# Altium project VISION_BETA_EBB.PrjPcb (part 5 of 9)

## Sheet GMSL_DESERIALIZER.SchDoc
size C; SheetNumber: 3; SheetTotal: 19
Used 2 times, as channels GMSL_DESERIALIZER_0, GMSL_DESERIALIZER_1. Parts and nets are listed once, with the designators drawn on the sheet.
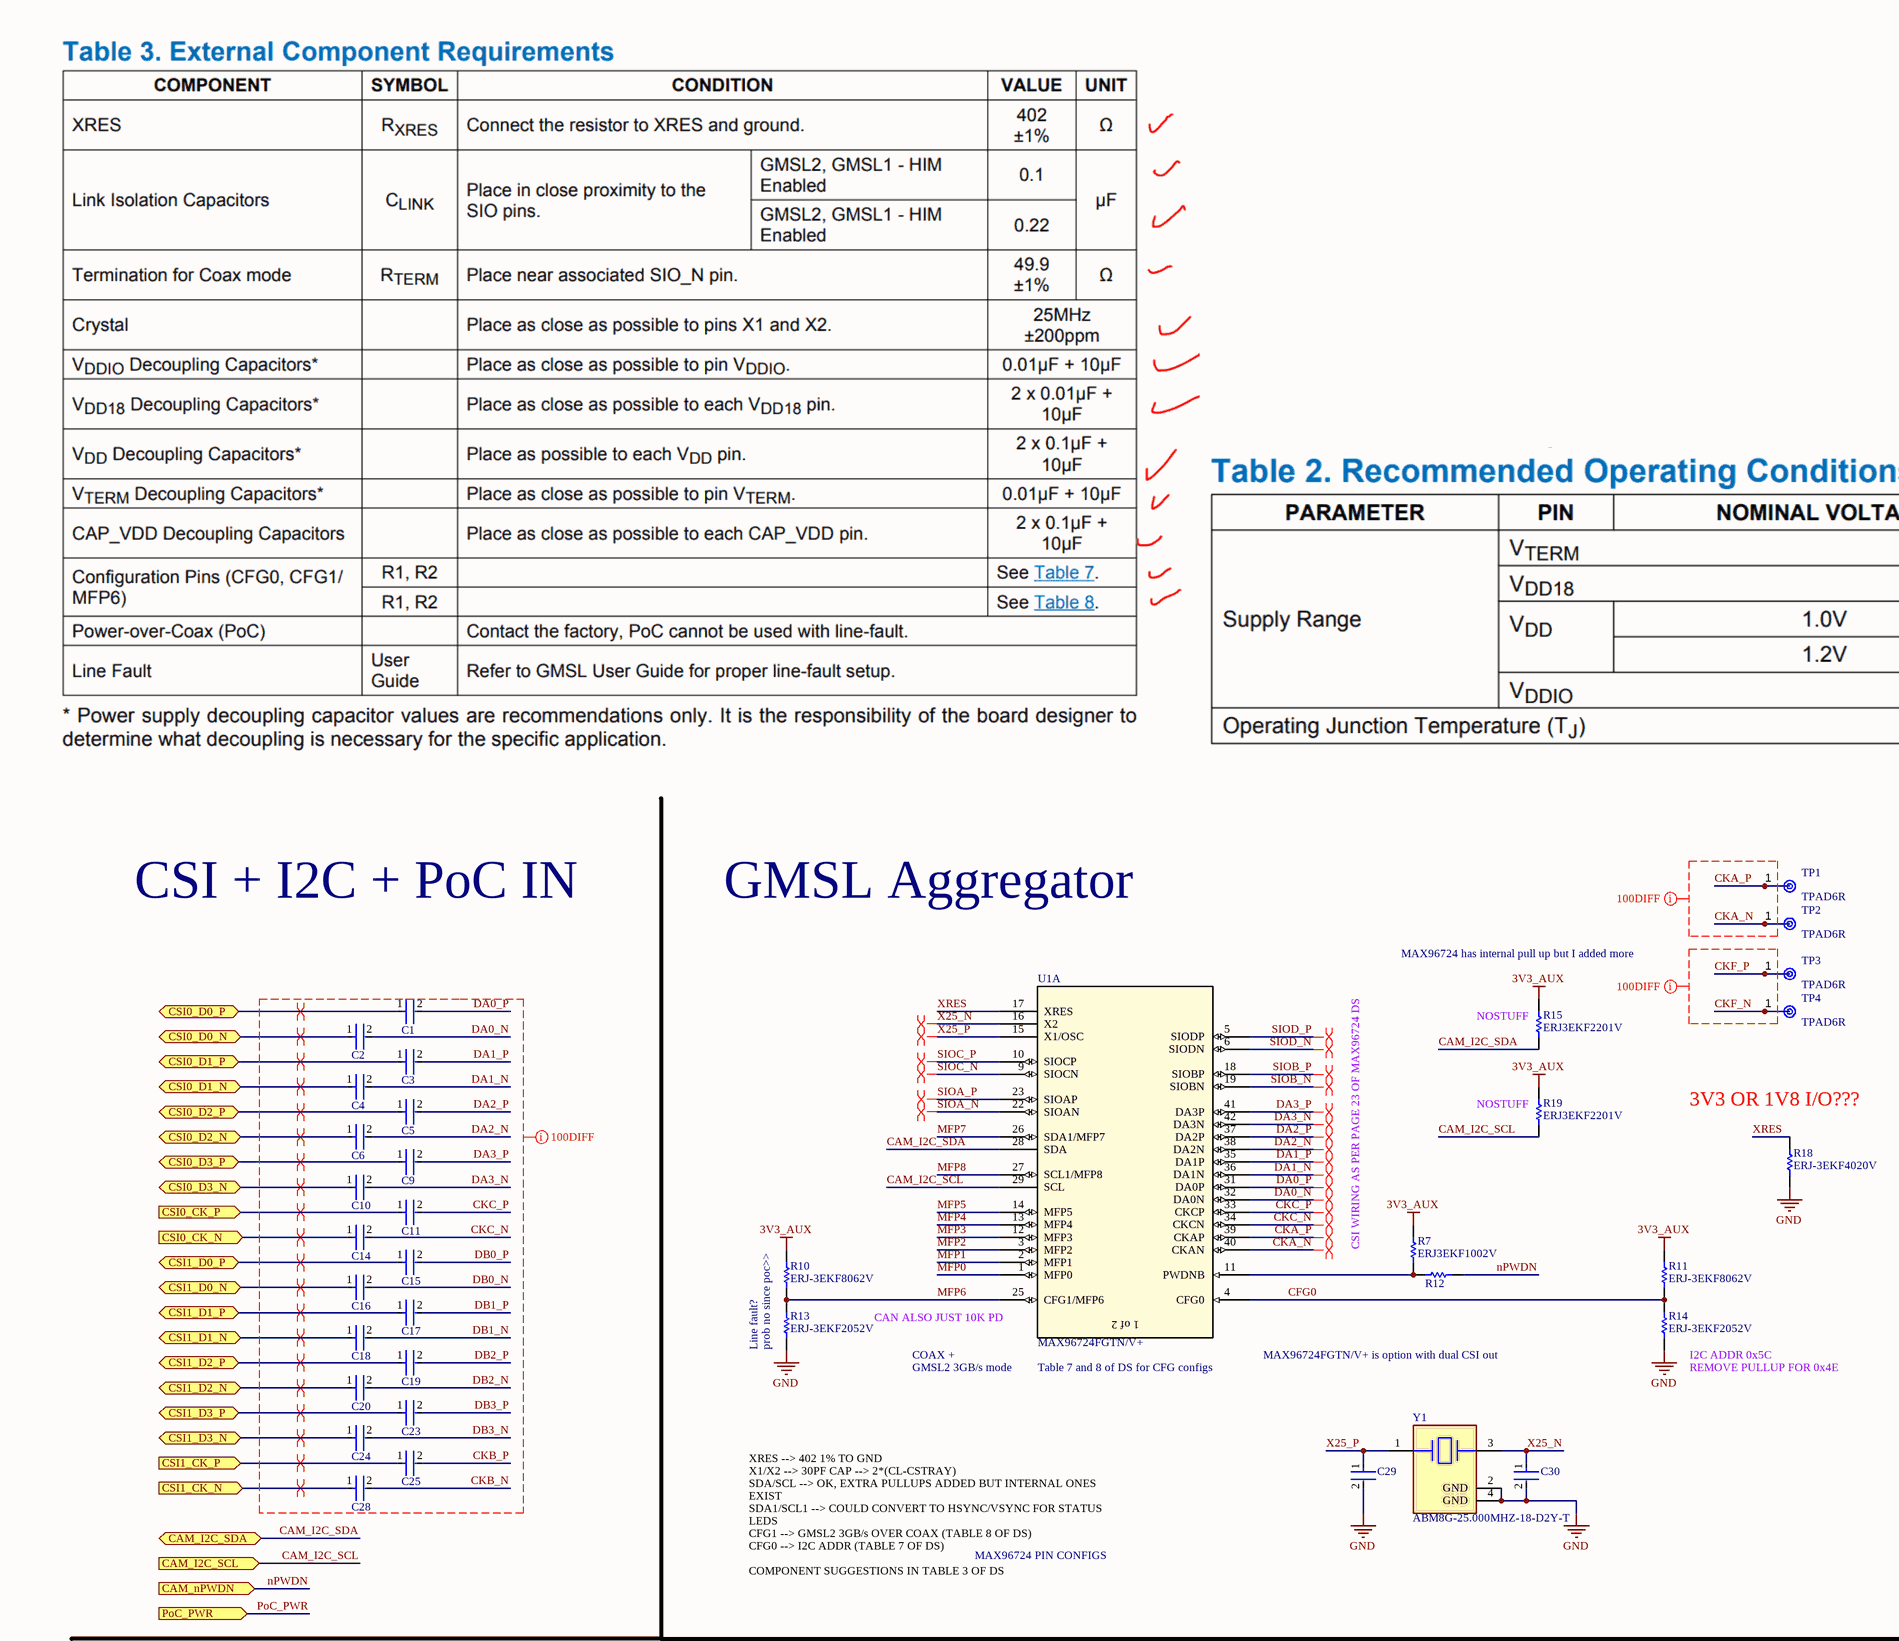
[diagram p23: GMSL_DESERIALIZER.SchDoc, top left]
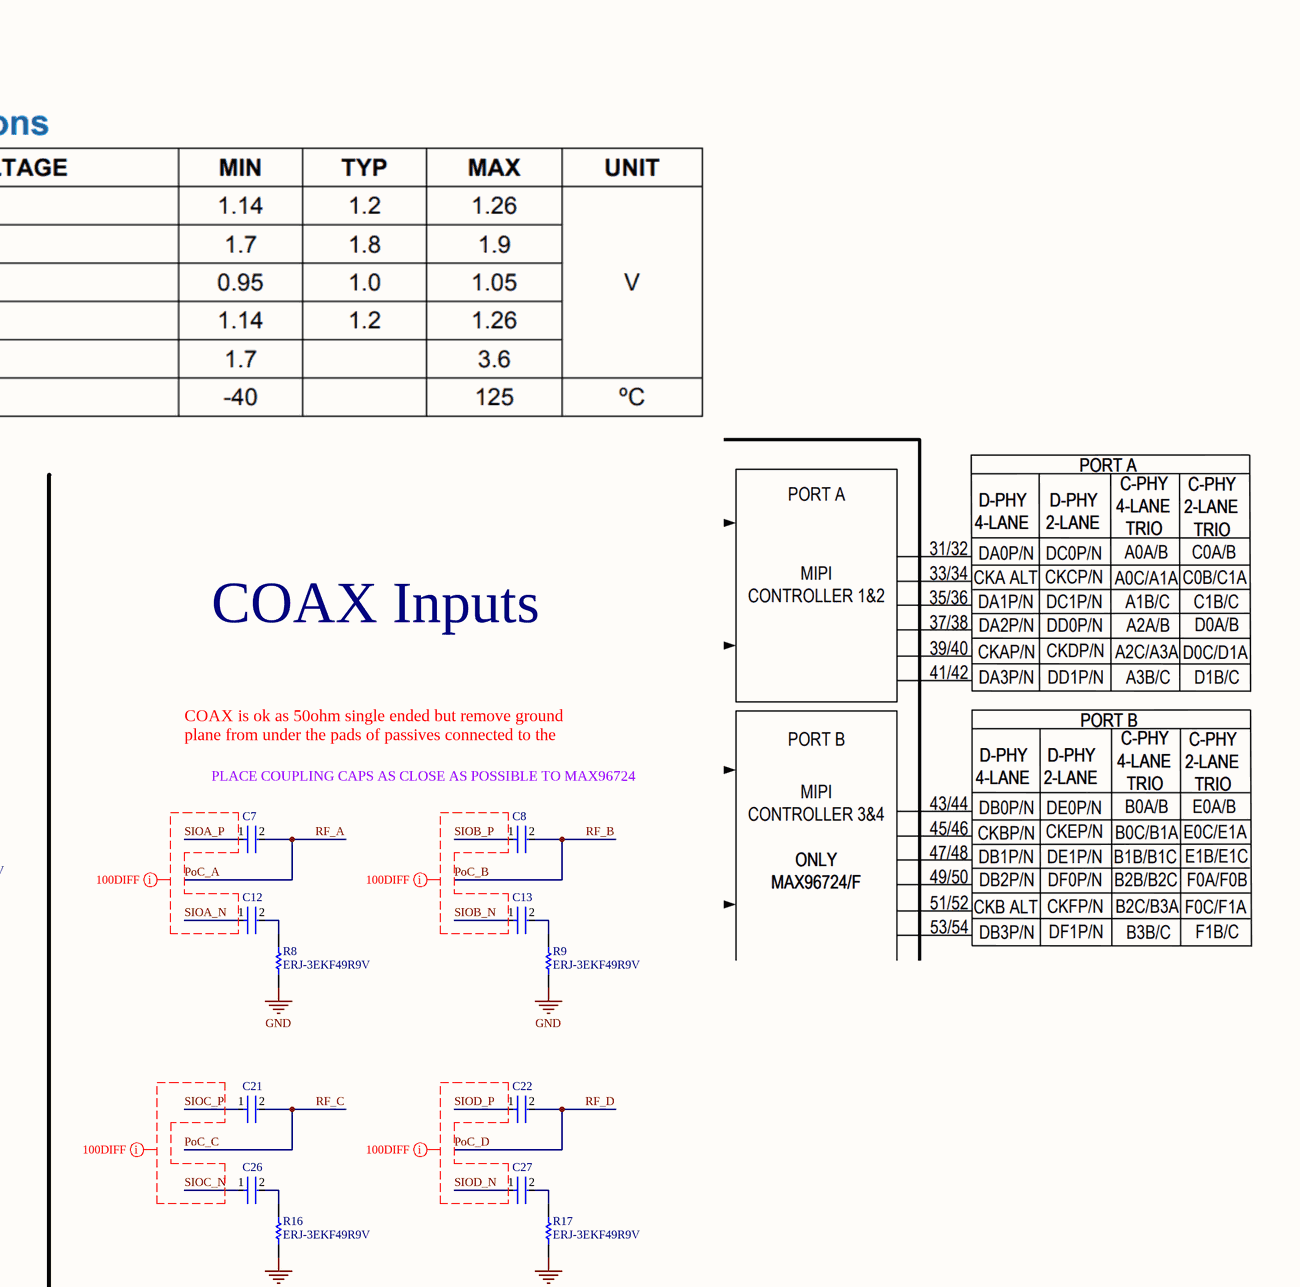
[diagram p24: GMSL_DESERIALIZER.SchDoc, top right]
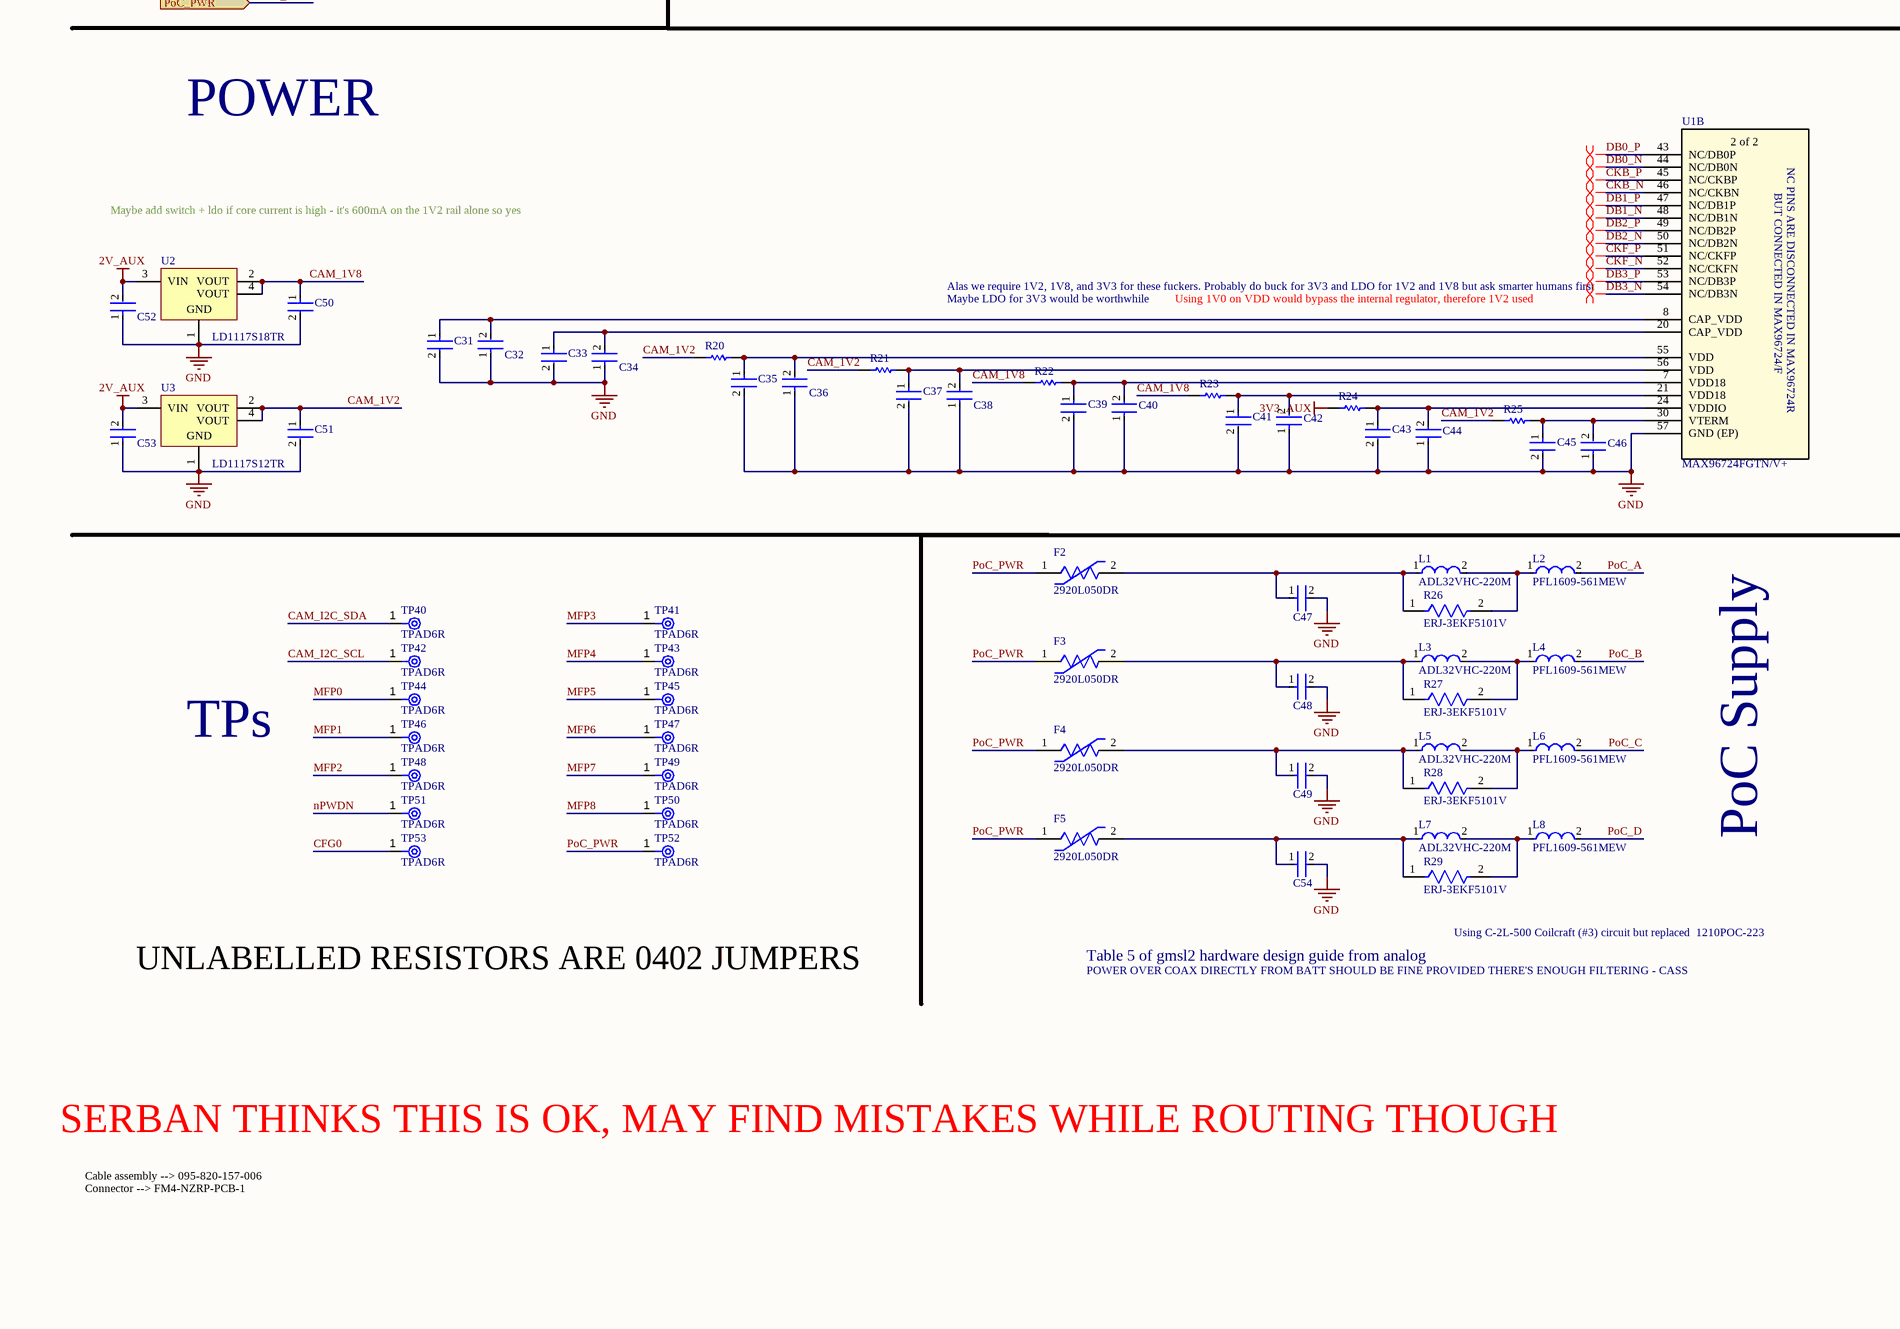
[diagram p25: GMSL_DESERIALIZER.SchDoc, bottom left]
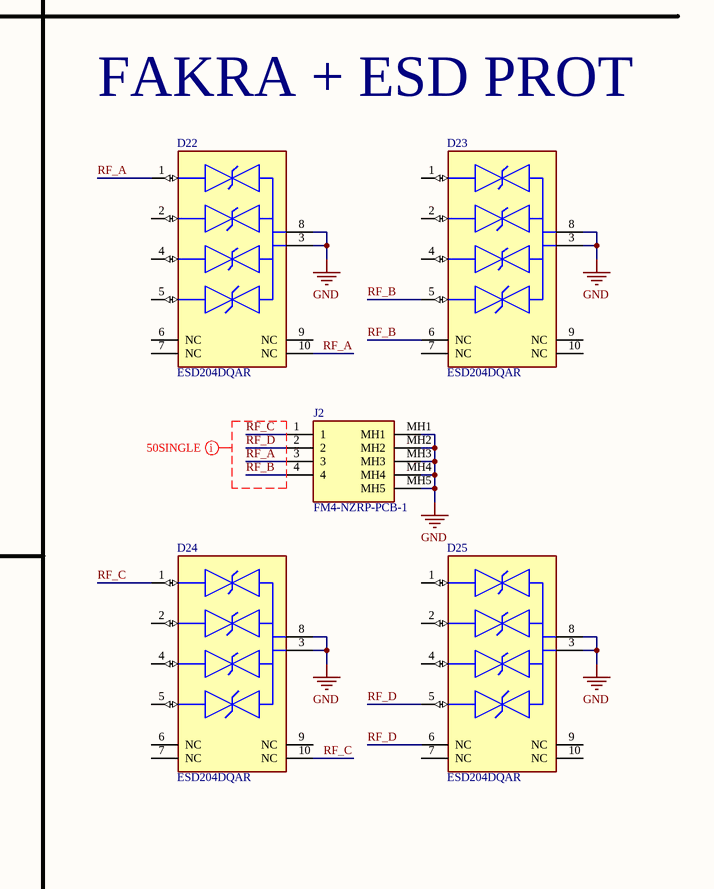
[diagram p26: GMSL_DESERIALIZER.SchDoc, bottom right]

### Parts
C1  C1005X7R1H104K050BB  [FP-C1005-050-0_05-IPC_C]  (value not drawn)
C2  C1005X7R1H104K050BB  [FP-C1005-050-0_05-IPC_C]  (value not drawn)
C3  C1005X7R1H104K050BB  [FP-C1005-050-0_05-IPC_C]  (value not drawn)
C4  C1005X7R1H104K050BB  [FP-C1005-050-0_05-IPC_C]  (value not drawn)
C5  C1005X7R1H104K050BB  [FP-C1005-050-0_05-IPC_C]  (value not drawn)
C6  C1005X7R1H104K050BB  [FP-C1005-050-0_05-IPC_C]  (value not drawn)
C7  C1005X7R1A224K050BB  [FP-C1005-050-0_05-IPC_C]  (value not drawn)
C8  C1005X7R1A224K050BB  [FP-C1005-050-0_05-IPC_C]  (value not drawn)
C9  C1005X7R1H104K050BB  [FP-C1005-050-0_05-IPC_C]  (value not drawn)
C10  C1005X7R1H104K050BB  [FP-C1005-050-0_05-IPC_C]  (value not drawn)
C11  C1005X7R1H104K050BB  [FP-C1005-050-0_05-IPC_C]  (value not drawn)
C12  C1005X7R1A224K050BB  [FP-C1005-050-0_05-IPC_C]  (value not drawn)
C13  C1005X7R1A224K050BB  [FP-C1005-050-0_05-IPC_C]  (value not drawn)
C14  C1005X7R1H104K050BB  [FP-C1005-050-0_05-IPC_C]  (value not drawn)
C15  C1005X7R1H104K050BB  [FP-C1005-050-0_05-IPC_C]  (value not drawn)
C16  C1005X7R1H104K050BB  [FP-C1005-050-0_05-IPC_C]  (value not drawn)
C17  C1005X7R1H104K050BB  [FP-C1005-050-0_05-IPC_C]  (value not drawn)
C18  C1005X7R1H104K050BB  [FP-C1005-050-0_05-IPC_C]  (value not drawn)
C19  C1005X7R1H104K050BB  [FP-C1005-050-0_05-IPC_C]  (value not drawn)
C20  C1005X7R1H104K050BB  [FP-C1005-050-0_05-IPC_C]  (value not drawn)
C21  C1005X7R1A224K050BB  [FP-C1005-050-0_05-IPC_C]  (value not drawn)
C22  C1005X7R1A224K050BB  [FP-C1005-050-0_05-IPC_C]  (value not drawn)
C23  C1005X7R1H104K050BB  [FP-C1005-050-0_05-IPC_C]  (value not drawn)
C24  C1005X7R1H104K050BB  [FP-C1005-050-0_05-IPC_C]  (value not drawn)
C25  C1005X7R1H104K050BB  [FP-C1005-050-0_05-IPC_C]  (value not drawn)
C26  C1005X7R1A224K050BB  [FP-C1005-050-0_05-IPC_C]  (value not drawn)
C27  C1005X7R1A224K050BB  [FP-C1005-050-0_05-IPC_C]  (value not drawn)
C28  C1005X7R1H104K050BB  [FP-C1005-050-0_05-IPC_C]  (value not drawn)
C29  C0603C300J5GACTU  [FP-C0603C-CF-MFG]  (value not drawn)
C30  C0603C300J5GACTU  [FP-C0603C-CF-MFG]  (value not drawn)
C31  CL05A106MP5NUNC  [FP-CL05A106MP5NUNC-MFG]  (value not drawn)
C32  C1005X7R1H104K050BB  [FP-C1005-050-0_05-IPC_C]  (value not drawn)
C33  CL05A106MP5NUNC  [FP-CL05A106MP5NUNC-MFG]  (value not drawn)
C34  C1005X7R1H104K050BB  [FP-C1005-050-0_05-IPC_C]  (value not drawn)
C35  CL05A106MP5NUNC  [FP-CL05A106MP5NUNC-MFG]  (value not drawn)
C36  C1005X7R1H104K050BB  [FP-C1005-050-0_05-IPC_C]  (value not drawn)
C37  CL05A106MP5NUNC  [FP-CL05A106MP5NUNC-MFG]  (value not drawn)
C38  C1005X7R1H104K050BB  [FP-C1005-050-0_05-IPC_C]  (value not drawn)
C39  CL05A106MP5NUNC  [FP-CL05A106MP5NUNC-MFG]  (value not drawn)
C40  C0402C103M5RACTU  [FP-C0402-BB-MFG]  (value not drawn)
C41  CL05A106MP5NUNC  [FP-CL05A106MP5NUNC-MFG]  (value not drawn)
C42  C0402C103M5RACTU  [FP-C0402-BB-MFG]  (value not drawn)
C43  CL05A106MP5NUNC  [FP-CL05A106MP5NUNC-MFG]  (value not drawn)
C44  C0402C103M5RACTU  [FP-C0402-BB-MFG]  (value not drawn)
C45  CL05A106MP5NUNC  [FP-CL05A106MP5NUNC-MFG]  (value not drawn)
C46  C0402C103M5RACTU  [FP-C0402-BB-MFG]  (value not drawn)
C47  GRM21BR61E226ME44L  [FP-GRM21B-0_2-e0_2_0_7-IPC_B]  (value not drawn)
C48  GRM21BR61E226ME44L  [FP-GRM21B-0_2-e0_2_0_7-IPC_B]  (value not drawn)
C49  GRM21BR61E226ME44L  [FP-GRM21B-0_2-e0_2_0_7-IPC_B]  (value not drawn)
C50  GRM188R60J106ME47D  [FP-GRM188-0_1-e0_2_0_55-IPC_A]  (value not drawn)
C51  GRM188R60J106ME47D  [FP-GRM188-0_1-e0_2_0_55-IPC_A]  (value not drawn)
C52  C1005X7R1H104K050BB  [FP-C1005-050-0_05-IPC_C]  (value not drawn)
C53  C1005X7R1H104K050BB  [FP-C1005-050-0_05-IPC_C]  (value not drawn)
C54  GRM21BR61E226ME44L  [FP-GRM21B-0_2-e0_2_0_7-IPC_B]  (value not drawn)
D22  ESD204DQAR  [FP-DQA0010A-MFG]
D23  ESD204DQAR  [FP-DQA0010A-MFG]
D24  ESD204DQAR  [FP-DQA0010A-MFG]
D25  ESD204DQAR  [FP-DQA0010A-MFG]
F2  2920L050DR  [FP-2920L050DR-MFG]
F3  2920L050DR  [FP-2920L050DR-MFG]
F4  2920L050DR  [FP-2920L050DR-MFG]
F5  2920L050DR  [FP-2920L050DR-MFG]
J2  FM4-NZRP-PCB-1  [FM4-NZRP-PCB-1-Footprint-1]
L1  ADL32VHC-220M  [FP-1210POC-MFG]
L2  PFL1609-561MEW  [FP-PFL1609-MFG]
L3  ADL32VHC-220M  [FP-1210POC-MFG]
L4  PFL1609-561MEW  [FP-PFL1609-MFG]
L5  ADL32VHC-220M  [FP-1210POC-MFG]
L6  PFL1609-561MEW  [FP-PFL1609-MFG]
L7  ADL32VHC-220M  [FP-1210POC-MFG]
L8  PFL1609-561MEW  [FP-PFL1609-MFG]
R7  ERJ3EKF1002V  [RESC1609X55X30LL15T15]
R8  ERJ-3EKF49R9V  [RESC1608X55X30ML15T15]
R9  ERJ-3EKF49R9V  [RESC1608X55X30ML15T15]
R10  ERJ-3EKF8062V  [RESC1608X55X30LL15T15]
R11  ERJ-3EKF8062V  [RESC1608X55X30LL15T15]
R12  0402 JUMPER  [RESC1005X40X25ML05T05]  (value not drawn)
R13  ERJ-3EKF2052V  [RESC1608X55X30NL15T15]
R14  ERJ-3EKF2052V  [RESC1608X55X30NL15T15]
R15  ERJ3EKF2201V  [RESC1608X55X30LL15T15]
R16  ERJ-3EKF49R9V  [RESC1608X55X30ML15T15]
R17  ERJ-3EKF49R9V  [RESC1608X55X30ML15T15]
R18  ERJ-3EKF4020V  [RESC1608X55X30LL15T15]
R19  ERJ3EKF2201V  [RESC1608X55X30LL15T15]
R20  RC0402JR-070RL  [RESC1005X40X25NL05T10]  (value not drawn)
R21  RC0402JR-070RL  [RESC1005X40X25NL05T10]  (value not drawn)
R22  RC0402JR-070RL  [RESC1005X40X25NL05T10]  (value not drawn)
R23  RC0402JR-070RL  [RESC1005X40X25NL05T10]  (value not drawn)
R24  RC0402JR-070RL  [RESC1005X40X25NL05T10]  (value not drawn)
R25  RC0402JR-070RL  [RESC1005X40X25NL05T10]  (value not drawn)
R26  ERJ-3EKF5101V  [FP-ERJ3EK-MFG]
R27  ERJ-3EKF5101V  [FP-ERJ3EK-MFG]
R28  ERJ-3EKF5101V  [FP-ERJ3EK-MFG]
R29  ERJ-3EKF5101V  [FP-ERJ3EK-MFG]
TP1  TPAD6R  [New footprint 1]
TP2  TPAD6R  [New footprint 1]
TP3  TPAD6R  [New footprint 1]
TP4  TPAD6R  [New footprint 1]
TP40  TPAD6R  [New footprint 1]
TP41  TPAD6R  [New footprint 1]
TP42  TPAD6R  [New footprint 1]
TP43  TPAD6R  [New footprint 1]
TP44  TPAD6R  [New footprint 1]
TP45  TPAD6R  [New footprint 1]
TP46  TPAD6R  [New footprint 1]
TP47  TPAD6R  [New footprint 1]
TP48  TPAD6R  [New footprint 1]
TP49  TPAD6R  [New footprint 1]
TP50  TPAD6R  [New footprint 1]
TP51  TPAD6R  [New footprint 1]
TP52  TPAD6R  [New footprint 1]
TP53  TPAD6R  [New footprint 1]
U1  MAX96724FGTN/V+  [MAX96724FGTN_V+-Footprint-1]  (parts A,B of 2)
U2  LD1117S18TR  [SOT-223_M]
U3  LD1117S12TR  [SOT-223_M]
Y1  ABM8G-25.000MHZ-18-D2Y-T  [FP-ABM8G-MFG]

### Ports
CAM_I2C_SCL (in, see VISION_BETA_EBB[6B], JETSON[10C]), CAM_I2C_SDA (bidir, see VISION_BETA_EBB[6B], JETSON[10C]), CAM_nPWDN (in, see VISION_BETA_EBB[6B]), CSI0_CK_N (in, see VISION_BETA_EBB[6B]), CSI0_CK_P (in, see VISION_BETA_EBB[6B]), CSI0_D0_N (bidir, see VISION_BETA_EBB[6B], JETSON[9A]), CSI0_D0_P (bidir, see VISION_BETA_EBB[6B], JETSON[9A]), CSI0_D1_N (bidir, see VISION_BETA_EBB[6B], JETSON[9A]), CSI0_D1_P (bidir, see VISION_BETA_EBB[6B], JETSON[9B]), CSI0_D2_N (bidir, see VISION_BETA_EBB[6B]), CSI0_D2_P (bidir, see VISION_BETA_EBB[6B]), CSI0_D3_N (bidir, see VISION_BETA_EBB[6B]), CSI0_D3_P (bidir, see VISION_BETA_EBB[6B]), CSI1_CK_N (in, see VISION_BETA_EBB[6B]), CSI1_CK_P (in, see VISION_BETA_EBB[6B]), CSI1_D0_N (bidir, see VISION_BETA_EBB[6B]), CSI1_D0_P (bidir, see VISION_BETA_EBB[6B]), CSI1_D1_N (bidir, see VISION_BETA_EBB[6B]), CSI1_D1_P (bidir, see VISION_BETA_EBB[6B]), CSI1_D2_N (bidir, see VISION_BETA_EBB[6B]), CSI1_D2_P (bidir, see VISION_BETA_EBB[6B]), CSI1_D3_N (bidir, see VISION_BETA_EBB[6B]), CSI1_D3_P (bidir, see VISION_BETA_EBB[6B]), PoC_PWR (in, see VISION_BETA_EBB[6B], GMSL_SERIALIZER[1B])

### Nets
2V_AUX: C52.2 C53.2 U2.3(VIN) U3.3(VIN)
3V3_AUX: R7.2 R10.2 R11.2 R15.2 R19.2 R24.1
GND: C29.2 C30.2 C31.2 C32.1 C33.2 C34.1 C35.2 C36.1 C37.2 C38.1 C39.2 C40.1 C41.2 C42.1 C43.2 C44.1 C45.2 C46.1 C47.2 C48.2 C49.2 C50.2 C51.2 C52.1 C53.1 C54.2 D22.3(GND) D22.8(GND) D23.3(GND) D23.8(GND) D24.3(GND) D24.8(GND) D25.3(GND) D25.8(GND) J2.MH1 J2.MH2 J2.MH3 J2.MH4 J2.MH5 R8.1 R9.1 R13.1 R14.1 R16.1 R17.1 R18.1 U1.57(GND_(EP)) U2.1(GND) U3.1(GND) Y1.2(GND) Y1.4(GND)
CAM_1V2: C51.1 R20.1 R21.1 R25.1 U3.2(VOUT) U3.4(VOUT)
CAM_1V8: C50.1 R22.1 R23.1 U2.2(VOUT) U2.4(VOUT)
CAM_I2C_SCL: R19.1 TP42.1(TP) U1.29(SCL) ; port CAM_I2C_SCL
CAM_I2C_SDA: R15.1 TP40.1(TP) U1.28(SDA) ; port CAM_I2C_SDA
CFG0: R11.1 R14.2 TP53.1(TP) U1.4(CFG0)
CKA_N: TP2.1(TP) U1.40(CKAN)
CKA_P: TP1.1(TP) U1.39(CKAP)
CKB_N: C28.2 U1.46(NC/CKBN)
CKB_P: C25.2 U1.45(NC/CKBP)
CKC_N: C14.2 U1.34(CKCN)
CKC_P: C11.2 U1.33(CKCP)
CKF_N: TP4.1(TP) U1.52(NC/CKFN)
CKF_P: TP3.1(TP) U1.51(NC/CKFP)
CSI0_CK_N: C14.1 ; port CSI0_CK_N
CSI0_CK_P: C11.1 ; port CSI0_CK_P
CSI0_D0_N: C2.1 ; port CSI0_D0_N
CSI0_D0_P: C1.1 ; port CSI0_D0_P
CSI0_D1_N: C4.1 ; port CSI0_D1_N
CSI0_D1_P: C3.1 ; port CSI0_D1_P
CSI0_D2_N: C6.1 ; port CSI0_D2_N
CSI0_D2_P: C5.1 ; port CSI0_D2_P
CSI0_D3_N: C10.1 ; port CSI0_D3_N
CSI0_D3_P: C9.1 ; port CSI0_D3_P
CSI1_CK_N: C28.1 ; port CSI1_CK_N
CSI1_CK_P: C25.1 ; port CSI1_CK_P
CSI1_D0_N: C16.1 ; port CSI1_D0_N
CSI1_D0_P: C15.1 ; port CSI1_D0_P
CSI1_D1_N: C18.1 ; port CSI1_D1_N
CSI1_D1_P: C17.1 ; port CSI1_D1_P
CSI1_D2_N: C20.1 ; port CSI1_D2_N
CSI1_D2_P: C19.1 ; port CSI1_D2_P
CSI1_D3_N: C24.1 ; port CSI1_D3_N
CSI1_D3_P: C23.1 ; port CSI1_D3_P
DA0_N: C2.2 U1.32(DA0N)
DA0_P: C1.2 U1.31(DA0P)
DA1_N: C4.2 U1.36(DA1N)
DA1_P: C3.2 U1.35(DA1P)
DA2_N: C6.2 U1.38(DA2N)
DA2_P: C5.2 U1.37(DA2P)
DA3_N: C10.2 U1.42(DA3N)
DA3_P: C9.2 U1.41(DA3P)
DB0_N: C16.2 U1.44(NC/DB0N)
DB0_P: C15.2 U1.43(NC/DB0P)
DB1_N: C18.2 U1.48(NC/DB1N)
DB1_P: C17.2 U1.47(NC/DB1P)
DB2_N: C20.2 U1.50(NC/DB2N)
DB2_P: C19.2 U1.49(NC/DB2P)
DB3_N: C24.2 U1.54(NC/DB3N)
DB3_P: C23.2 U1.53(NC/DB3P)
MFP0: TP44.1(TP) U1.1(MFP0)
MFP1: TP46.1(TP) U1.2(MFP1)
MFP2: TP48.1(TP) U1.3(MFP2)
MFP3: TP41.1(TP) U1.12(MFP3)
MFP4: TP43.1(TP) U1.13(MFP4)
MFP5: TP45.1(TP) U1.14(MFP5)
MFP6: R10.1 R13.2 TP47.1(TP) U1.25(CFG1/MFP6)
MFP7: TP49.1(TP) U1.26(SDA1/MFP7)
MFP8: TP50.1(TP) U1.27(SCL1/MFP8)
nPWDN: R12.2 TP51.1(TP) ; port CAM_nPWDN
PoC_A: C7.2 D22.1(IO1) D22.10(NC) J2.3 L2.2  [also labelled RF_A]
PoC_B: C8.2 D23.5(IO4) D23.6(NC) J2.4 L4.2  [also labelled RF_B]
PoC_C: C21.2 D24.1(IO1) D24.10(NC) J2.1 L6.2  [also labelled RF_C]
PoC_D: C22.2 D25.5(IO4) D25.6(NC) J2.2 L8.2  [also labelled RF_D]
PoC_PWR: F2.1 F3.1 F4.1 F5.1 TP52.1(TP) ; port PoC_PWR
SIOA_N: C12.1 U1.22(SIOAN)
SIOA_P: C7.1 U1.23(SIOAP)
SIOB_N: C13.1 U1.19(SIOBN)
SIOB_P: C8.1 U1.18(SIOBP)
SIOC_N: C26.1 U1.9(SIOCN)
SIOC_P: C21.1 U1.10(SIOCP)
SIOD_N: C27.1 U1.6(SIODN)
SIOD_P: C22.1 U1.5(SIODP)
X25_N: C30.1 U1.16(X2) Y1.3
X25_P: C29.1 U1.15(X1/OSC) Y1.1
XRES: R18.2 U1.17(XRES)
NetC12_2: C12.2 R8.2
NetC13_2: C13.2 R9.2
NetC26_2: C26.2 R16.2
NetC27_2: C27.2 R17.2
NetC31_1: C31.1 C32.2 U1.8(CAP_VDD)
NetC33_1: C33.1 C34.2 U1.20(CAP_VDD)
NetC35_1: C35.1 C36.2 R20.2 U1.55(VDD)
NetC37_1: C37.1 C38.2 R21.2 U1.56(VDD)
NetC39_1: C39.1 C40.2 R22.2 U1.7(VDD18)
NetC41_1: C41.1 C42.2 R23.2 U1.21(VDD18)
NetC43_1: C43.1 C44.2 R24.2 U1.24(VDDIO)
NetC45_1: C45.1 C46.2 R25.2 U1.30(VTERM)
NetC47_1: C47.1 F2.2 L1.1 R26.1
NetC48_1: C48.1 F3.2 L3.1 R27.1
NetC49_1: C49.1 F4.2 L5.1 R28.1
NetC54_1: C54.1 F5.2 L7.1 R29.1
NetL1_2: L1.2 L2.1 R26.2
NetL3_2: L3.2 L4.1 R27.2
NetL5_2: L5.2 L6.1 R28.2
NetL7_2: L7.2 L8.1 R29.2
NetR7_1: R7.1 R12.1 U1.11(PWDNB)

Not connected (* = marked no-connect by the designer): D22 2(IO2) 4(IO3) 5(IO4) 6(NC) 7(NC) 9(NC); D23 1(IO1) 2(IO2) 4(IO3) 7(NC) 9(NC) 10(NC); D24 2(IO2) 4(IO3) 5(IO4) 6(NC) 7(NC) 9(NC); D25 1(IO1) 2(IO2) 4(IO3) 7(NC) 9(NC) 10(NC)

### Channels
GMSL_DESERIALIZER_0: designators end in _GMSL_DESERIALIZER_0; ports CAM_I2C_SCL=CAM_I2C_SCL CAM_I2C_SDA=CAM_I2C_SDA CAM_nPWDN=CAM0_PWDN CSI0_CK_N=CSI0_CLK_N CSI0_CK_P=CSI0_CLK_P CSI0_D0_N=CSI0_D0_N CSI0_D0_P=CSI0_D0_P CSI0_D1_N=CSI0_D1_N CSI0_D1_P=CSI0_D1_P CSI0_D2_N=CSI1_D0_N CSI0_D2_P=CSI1_D0_P CSI0_D3_N=CSI1_D1_N CSI0_D3_P=CSI1_D1_P CSI1_CK_N=PRE_CK_N CSI1_CK_P=PRE_CK_P CSI1_D0_N=PRE_D0_N CSI1_D0_P=PRE_D0_P CSI1_D1_N=PRE_D1_N CSI1_D1_P=PRE_D1_P CSI1_D2_N=PRE_D2_N CSI1_D2_P=PRE_D2_P CSI1_D3_N=PRE_D3_N CSI1_D3_P=PRE_D3_P PoC_PWR=INT_VCC
GMSL_DESERIALIZER_1: designators end in _GMSL_DESERIALIZER_1; ports CAM_I2C_SCL=CAM_I2C_SCL CAM_I2C_SDA=CAM_I2C_SDA CAM_nPWDN=CAM1_PWDN CSI0_CK_N=CSI2_CLK_N CSI0_CK_P=CSI2_CLK_P CSI0_D0_N=CSI2_D0_N CSI0_D0_P=CSI2_D0_P CSI0_D1_N=CSI2_D1_N CSI0_D1_P=CSI2_D1_P CSI0_D2_N=CSI3_D0_N CSI0_D2_P=CSI3_D0_P CSI0_D3_N=CSI3_D1_N CSI0_D3_P=CSI3_D1_P CSI1_CK_N=TP_CSI1_CK_N CSI1_CK_P=TP_CSI1_CK_P CSI1_D0_N=TP_CSI1_D0_N CSI1_D0_P=TP_CSI1_D0_P CSI1_D1_N=TP_CSI1_D1_N CSI1_D1_P=TP_CSI1_D1_P CSI1_D2_N=TP_CSI1_D2_N CSI1_D2_P=TP_CSI1_D2_P CSI1_D3_N=TP_CSI1_D3_N CSI1_D3_P=TP_CSI1_D3_P PoC_PWR=INT_VCC

### Layout directives
differential pair; differential pair class 100DIFF: CKA_N_GMSL_DESERIALIZER_0, CKA_P_GMSL_DESERIALIZER_0, CKB_N_GMSL_DESERIALIZER_0, CKB_P_GMSL_DESERIALIZER_0, CKC_N_GMSL_DESERIALIZER_0, CKC_P_GMSL_DESERIALIZER_0, CKF_N_GMSL_DESERIALIZER_0, CKF_P_GMSL_DESERIALIZER_0, CSI0_CLK_N, CSI0_CLK_P, CSI0_D0_N, CSI0_D0_P, CSI0_D1_N, CSI0_D1_P, CSI1_D0_N, CSI1_D0_P, CSI1_D1_N, CSI1_D1_P, DA0_N_GMSL_DESERIALIZER_0, DA0_P_GMSL_DESERIALIZER_0, DA1_N_GMSL_DESERIALIZER_0, DA1_P_GMSL_DESERIALIZER_0, DA2_N_GMSL_DESERIALIZER_0, DA2_P_GMSL_DESERIALIZER_0, DA3_N_GMSL_DESERIALIZER_0, DA3_P_GMSL_DESERIALIZER_0, DB0_N_GMSL_DESERIALIZER_0, DB0_P_GMSL_DESERIALIZER_0, DB1_N_GMSL_DESERIALIZER_0, DB1_P_GMSL_DESERIALIZER_0, DB2_N_GMSL_DESERIALIZER_0, DB2_P_GMSL_DESERIALIZER_0, DB3_N_GMSL_DESERIALIZER_0, DB3_P_GMSL_DESERIALIZER_0, PRE_CK_N, PRE_CK_P, PRE_D0_N, PRE_D0_P, PRE_D1_N, PRE_D1_P, PRE_D2_N, PRE_D2_P, PRE_D3_N, PRE_D3_P, SIOA_N_GMSL_DESERIALIZER_0, SIOA_P_GMSL_DESERIALIZER_0, SIOB_N_GMSL_DESERIALIZER_0, SIOB_P_GMSL_DESERIALIZER_0, SIOC_N_GMSL_DESERIALIZER_0, SIOC_P_GMSL_DESERIALIZER_0, SIOD_N_GMSL_DESERIALIZER_0, SIOD_P_GMSL_DESERIALIZER_0
net class 50SINGLE: RF_A, RF_B, RF_C, RF_D
differential pair: X25_N_GMSL_DESERIALIZER_0, X25_P_GMSL_DESERIALIZER_0
net class 100DIFF: CKA_N, CKA_P, CKB_N, CKB_P, CKC_N, CKC_P, CKF_N, CKF_P, DA0_N, DA0_P, DA1_N, DA1_P, DA2_N, DA2_P, DA3_N, DA3_P, DB0_N, DB0_P, DB1_N, DB1_P, DB2_N, DB2_P, DB3_N, DB3_P, PoC_A, PoC_B, PoC_D, SIOA_N, SIOA_P, SIOB_N, SIOB_P, SIOC_N, SIOC_P, SIOD_N, SIOD_P

### Notes on the sheet
- CSI + I2C + PoC IN
- GMSL Aggregator
- MAX96724 has internal pull up but I added more
- COAX Inputs
- (near R15) NOSTUFF
- COAX is ok as 50ohm single ended but remove ground plane from under the pads of passives connected to the GMSL trace
- PLACE COUPLING CAPS AS CLOSE AS POSSIBLE TO MAX96724
- (near R19) NOSTUFF
- (near R18) 3V3 OR 1V8 I/O???
- CSI WIRING AS PER PAGE 23 OF MAX96724 DS
- Line fault?
- prob no since poc>>
- CAN ALSO JUST 10K PD
- GMSL2 3GB/s mode
- COAX +
- Table 7 and 8 of DS for CFG configs
- MAX96724FGTN/V+ is option with dual CSI out
- (near R14) I2C ADDR 0x5C
- (near R14) REMOVE PULLUP FOR 0x4E
- XRES --> 402 1% TO GND
  X1/X2 --> 30PF CAP --> 2*(CL-CSTRAY)
  SDA/SCL --> OK, EXTRA PULLUPS ADDED BUT INTERNAL ONES EXIST
  SDA1/SCL1 --> COULD CONVERT TO HSYNC/VSYNC FOR STATUS LEDS
  CFG1 --> GMSL2 3GB/s OVER COAX (TABLE 8 OF DS)
  CFG0 --> I2C ADDR (TABLE 7 OF DS)
  COMPONENT SUGGESTIONS IN TABLE 3 OF DS
  - DECOUPLING CAPS OK
- MAX96724 PIN CONFIGS
- FAKRA + ESD PROT
- POWER
- Maybe add switch + ldo if core current is high - it's 600mA on the 1V2 rail alone so yes
- (near U1) Alas we require 1V2, 1V8, and 3V3 for these fuckers. Probably do buck for 3V3 and LDO for 1V2 and 1V8 but ask smarter humans first
- Maybe LDO for 3V3 would be worthwhile
- Using 1V0 on VDD would bypass the internal regulator, therefore 1V2 used
- TPs
- PoC Supply
- Using C-2L-500 Coilcraft (#3) circuit but replaced  1210POC-223
- UNLABELLED RESISTORS ARE 0402 JUMPERS
- Table 5 of gmsl2 hardware design guide from analog
- POWER OVER COAX DIRECTLY FROM BATT SHOULD BE FINE PROVIDED THERE'S ENOUGH FILTERING - CASS
- SERBAN THINKS THIS IS OK, MAY FIND MISTAKES WHILE ROUTING THOUGH
- Cable assembly --> 095-820-157-006
  Connector --> FM4-NZRP-PCB-1
- (in symbol CMP-015-00011-2, part A) 1 of 2
- (in symbol CMP-015-00011-2, part B) 2 of 2; NC PINS ARE DISCONNECTED IN MAX96724R; BUT CONNECTED IN MAX96724/F

### Library data of the parts
C1-C6 C9-C11 C14-C20 C23-C25 C28 C32 C34 C36 C38 C52 C53 = CMP-2000-05393-2: as C102 on sheet HDMI; Voltage: 50V; Dielectric Material: Ceramic; Min Operating Temperature: -55°C; Depth: 0.5mm; Radiation Hardening: No; RoHS Compliant: Yes; Voltage Rating (DC): 50V; Lead Free: Lead Free; Resistor Type: Ceramic; Height: 0.5mm; Dielectric: X7R; Thickness: 0.022inch; Case/Package: 0402; Case Code (Metric): 1005; Termination: SMD/SMT; Capacitance: 100nF; Packaging: Tape and Reel; Max Operating Temperature: 125°C; Mount: Surface Mount; Package Quantity: 1; Width: 0.02inch; Weight: 2.3E-05oz; Voltage Rating: 50V; Tolerance: 10%; Construction: Flat; Case Code (Imperial): 0402; Length: 1mm; REACH SVHC: No SVHC; Series: C
C7 C8 C12 C13 C21 C22 C26 C27 = CMP-08246-006072-1: as C119 on sheet NVME; Resistor Type: Ceramic; Dielectric: X7R; Voltage Rating (DC): 10V; Width: 0.02inch; Case Code (Metric): 1005; Mount: Surface Mount; Termination: SMD/SMT; Series: C; Tolerance: 10%; Depth: 0.5mm; Length: 1mm; Packaging: Tape and Reel; Radiation Hardening: No; Weight: 2.3E-05oz; Voltage Rating: 10V; Thickness: 0.022inch; Capacitance: 220nF; Case Code (Imperial): 0402; Lead Free: Lead Free; Case/Package: 0402; Package Quantity: 10000; Dielectric Material: Ceramic; RoHS Compliant: Yes; REACH SVHC: No SVHC; Min Operating Temperature: -55°C; Max Operating Temperature: 125°C; Height: 0.5mm; Construction: Flat
C29 C30 = CMP-1035-00914-3: CAP CER 30PF 50V 5% NP0 0603; Manufacturer: KEMET; Automotive Grade: Grade 1; Temperature Coefficient: 30ppm/°C; Material: Ceramic; Temperature Characteristic: C0G; Tolerance: 0.05; Manufacturer Part Number: C0603C300J5GACTU; ComponentLink2URL: https://api.kemet.com/component-edge/download/datasheet/C0603C100J5GACAUTO.pdf; Automotive: Yes; Device Class L2: Capacitors; Device Class L1: Passive Components; Device Class L3: Ceramic Capacitors; RoHS: TRUE; Octopart: https://octopart.com/c0603c300j5gactu-kemet-199455; Lead Free: Yes; Value: 30 pF; Temperature Range High: +125°C; Category: Cap; Temperature: -55°C to +125°C; Package: C0603C-CF; Capacitance: 30 pF; Digikey Description: CAP CER 30PF 50V 5% NP0 0603; Height: 0.87mm; ComponentLink2Description: Datasheet; Temperature Range Low: -55°C; Mouser Description: Multilayer Ceramic Capacitors MLCC - SMD/SMT 50volts 30pF C0G 5%; Voltage Rating: 50 V
C31 C33 C35 C37 C39 C41 C43 C45 = CMP-13271-000002-1: CAP CER 10UF 10V X5R 0402; Manufacturer: Samsung; Temperature Coefficient: 15%; Tolerance: 20%; Material: Ceramic; Octopart: https://octopart.com/cl05a106mp5nunc-samsung-22457395; Voltage Rating: 10V; RoHS: TRUE; Value: 10uF; Height: 0.7mm; Digikey Description: CAP CER 10UF 10V X5R 0402; Automotive: No; Package: CL05A106MP5NUNC; Device Class L1: Passive Components; Capacitance: 10uF; Temperature Range High: +85°C; ComponentLink2Description: Datasheet; Device Class L2: Capacitors; Temperature Characteristic: X5R; Manufacturer Part Number: CL05A106MP5NUNC; Temperature: -55°C to +85°C; ComponentLink2URL: http://www.samsungsem.com/kr/support/product-search/mlcc/__icsFiles/afieldfile/2019/05/10/19-CL05A106MP5NUNC.pdf; Device Class L3: Ceramic Capacitors; Category: Cap; Temperature Range Low: -55°C; Ipc Land Pattern Name: CAPC10050X50; Lead Free: Yes
C40 C42 C44 C46 = CMP-1034-01887-3: CAP CER 10000PF 50V 20% X7R 0402; Manufacturer: Kemet; Value: 10,000 pF; Tolerance: 0.2; Temperature Coefficient: 15%; Material: Ceramic; Temperature Range Low: -55°C; Digikey Description: CAP CER 10000PF 50V 20% X7R 0402; Temperature Characteristic: X7R; Device Class L2: Capacitors; RoHS: TRUE; Temperature Range High: +125°C; Mouser Description: Cap Ceramic 0.01uF 50V X7R 20% SMD 1.0 x 0.5 mm 125 C Paper T/R; Package: C0402-BB; ComponentLink2URL: https://content.kemet.com/datasheets/KEM_C1002_X7R_SMD.pdf; Device Class L1: Passive Components; ComponentLink2Description: Datasheet; Height: 0.55mm; Automotive: No; Temperature: -55°C to +125°C; Capacitance: 10,000 pF; Manufacturer Part Number: C0402C103M5RACTU; Device Class L3: Ceramic Capacitors; Voltage Rating: 50 V; Ipc Land Pattern Name: CAPC10050X50; Category: Cap; Octopart: https://octopart.com/c0402c103m5ractu-kemet-17125571; Lead Free: Yes
C47-C49 C54 = CMP-2007-03222-3: Chip Multilayer Ceramic Capacitors for General Purpose, 0805, 22uF, X5R, 15%, 20%, 25V; Case/Package: 0805; Depth: 1.25mm; Resistor Type: Ceramic; Voltage Rating: 25V; Lead Free: Lead Free; Voltage Rating (DC): 25V; Case Code (Metric): 2012; Thickness: 0.057inch; REACH SVHC: No SVHC; Material: Ceramic; Tolerance: 20%; Length: 2mm; Capacitance: 22uF; Case Code (Imperial): 0805; Max Operating Temperature: 85°C; Termination: SMD/SMT; Weight: 0.000335oz; Dielectric: X5R; Packaging: Tape and Reel; Voltage: 25V; Package Quantity: 3000; Height: 1.25mm; Mount: Surface Mount; Width: 1.25mm; Min Operating Temperature: -55°C
C50 C51 = CMP-2006-02792-2: as C101 on sheet HDMI; Packaging: Tape and Reel; Voltage Rating (DC): 6.3V; Width: 0.031inch; Termination: SMD/SMT; Dielectric: X5R; Package Quantity: 4000; Voltage Rating: 6.3V; Capacitance: 10uF; Case/Package: 0603; Min Operating Temperature: -55°C; Voltage: 6.3V; Length: 1.6mm; Thickness: 0.035inch; Lead Free: Lead Free; Depth: 0.8mm; Case Code (Imperial): 0603; Max Operating Temperature: 85°C; Material: Ceramic; Height: 0.8mm; Tolerance: 20%; Mount: Surface Mount; REACH SVHC: No SVHC; Radiation Hardening: No; Case Code (Metric): 1608
D22-D25 = CMP-04989-000002-1: as D32-D34 on sheet HDMI; Ambient Temperature Range High: +125°C; ComponentLink2Description: Datasheet; Height: 0.55mm; Lead Free: Yes; Device Class L3: unset; Temperature Range High: +125°C; Temperature Range Low: -40°C; Package: DQA0010A; Temperature: -40°C to +125°C; Capacitance: 0.55pF; RoHS: TRUE; Mouser Description: 4-Channel Low-Capacitance Surge and ESD Protection Diode 10-USON -40 to 125; Category: Diode; Device Class L1: Circuit Protection; Octopart: https://octopart.com/esd204dqar-texas+instruments-89917476; Device Class L2: TVS Diodes; Ambient Temperature Range Low: -40°C; Manufacturer Part Number: ESD204DQAR; ComponentLink2URL: http://www.ti.com/lit/ds/symlink/esd204.pdf; Automotive: No; Digikey Description: 4-CHANNEL LOW-CAPACITANCE SURGE
F2-F5 = CMP-08606-000071-1: PTC RESET FUSE 60V 500MA 2920; Resistance: 1.4R; Trip Current: 1A; Power Dissipation: 1.5W; Time to Trip: 4s; Approvals: cULus; Current Rating: 10A; Operating Supply Voltage: 60V; Termination: SMD/SMT; Width: 5.44mm; Case/Package: 2920; Series: 2920L; Case Code (Imperial): 2920; Height: 1.25mm; Hold Current: 500mA; Terminal Material: Copper; Min Operating Temperature: -40°C; Package Quantity: 1500; Max Voltage Rating (DC): 60V; RoHS Compliant: Yes; Case Code (Metric): 7351; Lead Free: Lead Free; Max Operating Temperature: 85°C; Voltage Rating (DC): 60V; Working Voltage: 60V; Length: 7.98mm; REACH SVHC: No SVHC; Max Current Rating: 10A; Voltage Rating: 60V; Packaging: Tape and Reel
J2 = CMP-002-00044-2: Connector RF Mini-FAKRA Plug 9GHz 50Ohm Solder Right Angle Through Hole; Component Type: Standard; Pins: 9; Source: fakra4ch.SchLib; Design Item ID: CMP-002-00085-1
L1 L3 L5 L7 = CMP-11268-000041-1: NOT COILCRAFT - ACTUAL P# --> ADL32VHC-220M / - Power Injection Chokes for PoC; Manufacturer Part Number: 1210POC-223MRC; Value: 22uH; Core Material: Ferrite; Saturation Current: 720mA; Series Resistance: 0.88Ω; Rms Current: 700mA; Automotive Grade: Grade 1; Self Resonant Frequency: 70MHz; Test Frequency: 100kHz; Tolerance: 20%; Ambient Temperature Range High: +125°C; Manufacturer: coilcraft; Octopart: https://octopart.com/1210poc-223mrc-coilcraft-103207315; Category: Ind; Device Class L2: Inductors; RoHS: TRUE; Device Class L3: Fixed Inductors; Package: 1210POC; Ambient Temperature Range Low: -40°C; ComponentLink2URL: https://drive.google.com/open?id=15FlOq8Y4YbRFohfA_cJ40jgnqs8va2Mh; Lead Free: Yes; Inductance: 22uH; Device Class L1: Passive Components; ComponentLink2Description: Datasheet; Automotive: Yes; Height: 3mm
L2 L4 L6 L8 = CMP-11268-000007-1: Fixed Inductors PFL1609 Low Profile 0.56 uH 20 % 1.4 A; Manufacturer: coilcraft; Rms Current: 1100mA; Self Resonant Frequency: 600MHz; Core Material: Composite; Tolerance: 20%; Value: 0.56uH; Automotive Grade: Grade 1; Saturation Current: 710mA; Test Frequency: 7.9MHz; Shielding: true; Series Resistance: 130mΩ; Lead Free: Yes; Device Class L1: Passive Components; Package: PFL1609; Octopart: https://octopart.com/pfl1609-561mew-coilcraft-20329171; ComponentLink2URL: https://www.coilcraft.com/pdfs/pfl1609.pdf; Manufacturer Part Number: PFL1609-561MEW; Ambient Temperature Range Low: -40°C; Composition: Wirewound; Inductance: 0.56uH; Device Class L2: Inductors; Category: Ind; Device Class L3: Fixed Inductors; Mouser Description: Fixed Inductors PFL1609 Low Profile 0.56 uH 20 % 1.4 A; Automotive: Yes; ComponentLink2Description: Datasheet; Ambient Temperature Range High: +105°C; Height: 0.95mm; RoHS: TRUE
R7 = CMP-1012-00623-3: as R75 on sheet HDMI; Number of Pins: 2; Package Reference: 603; Depth: 0.8mm; Mount: SurfaceMount; Package Description: 2-Pin Surface Mount Device, Body 1.6 x 0.85 mm; Datasheet Version: 02/2017; Length: 1.6mm; Lead Free: LeadFree; Height: 0.45mm; Number of Terminations: 2; Max Power Dissipation: 100mW; Min Operating Temperature: -55degC; Datasheet URL: https://industrial.panasonic.com/cdbs/www-data/pdf/RDA0000/AOA0000C304.pdf; Termination: SMD/SMT; Case Code (Metric): 1608; Case Code (Imperial): 0603; Tolerance: 1%; Max Operating Temperature: 155degC; RoHSCompliant: true; Voltage Rating (DC): 75V; Radiation Hardening: No; Packaging: TapeandReel; Composition: ThickFilm; Mounting Technology: SurfaceMount; Manufacturer URL: http://www.panasonic.com/; Width: 0.031inch; REACH SVHC: NoSVHC; Contact Plating: Tin; Military Standard: Not; Package Quantity: 1
R8 R9 R16 R17 = CMP-2000-00538-1: Manufacturer: Panasonic; Part Number: ERJ-3EKF49R9V
R10 R11 = CMP-2000-00651-1: Manufacturer: Panasonic; Part Number: ERJ-3EKF8062V
R12 = CMP-009-00118-2: READ THE NAME; Pins: 2; Component Type: Standard; Design Item ID: CMP-009-00206-2; Source: 0402jump.SchLib
R13 R14 = CMP-2000-00323-1: Manufacturer: Panasonic; Part Number: ERJ-3EKF2052V
R15 R19 = CMP-2000-00336-1: Manufacturer: Panasonic; Part Number: ERJ3EKF2201V
R18 = CMP-2000-00484-1: Manufacturer: Panasonic; Part Number: ERJ-3EKF4020V
R20-R25 = CMP-1011-00001-2: Manufacturer: Yageo / Phycomp; Part Number: RC0402JR-070RL
R26-R29 = CMP-2000-00540-8: RES SMD 5.1K OHM 1% 1/10W 0603; Power Rating: 100mW; Temperature Coefficient: 100ppm/°C; Voltage Rating: 75V; Resistance: 5.1kR; Military Standard: Not; Case/Package: 0603; Packaging: Tape and Reel; Package Quantity: 1; Reach SVHC Compliant: Yes; Lead Free: Lead Free; Mount: Surface Mount; Size Code: 0603; Depth: 0.8mm; Resistance Tolerance: 1%; Number of Terminations: 2; Resistor Type: Thick Film; Width: 0.8mm; Construction: Rectangular; Series: ERJ; Radiation Hardening: No; Max Operating Temperature: 155°C; Features: Automotive AEC-Q200; Tolerance: 1%; Voltage Rating (DC): 75V; Length: 1.6mm; RoHS Compliant: Yes; Min Operating Temperature: -55°C; Case Code (Metric): 1608; Termination: SMD/SMT; Weight: 7.1E-05oz; Max Power Dissipation: 100mW; Contact Plating: Tin; Height: 0.022inch; Case Code (Imperial): 0603
TP1-TP4 TP40-TP53 = CMP-00025-2: Test Point .6mm
U1 = CMP-015-00011-2: Quad Tunneling GMSL2/1 to CSI-2 Deserializer
U2 = CMP-0244-00308-1: Fixed Low Drop Positive Voltage Regulator, 1.8V, 4-Pin SOT-223, Tape and Reel; ComponentLink1URL: http://www.st.com; PackageReference: SOT-223; PackageDescription: 4-Pin SOT-223 Package, 6.5 x 3.5 mm Body, 2.3 mm Pitch, 7 mm Lead Span; ComponentLink2URL: http://www.st.com/internet/com/TECHNICAL_RESOURCES/TECHNICAL_LITERATURE/DATASHEET/CD00000544.pdf; ComponentLink2Description: Datasheet; ComponentLink1Description: Manufacturer URL; DatasheetVersion: 1/11/2011; PackageVersion: 2010
U3 = CMP-0244-00318-1: Fixed Low Drop Positive Voltage Regulator, 1.2V, 4-Pin SOT-223, Tape and Reel; PackageDescription: 4-Pin SOT-223 Package, 6.5 x 3.5 mm Body, 2.3 mm Pitch, 7 mm Lead Span; PackageVersion: 2010; ComponentLink2Description: Datasheet; PackageReference: SOT-223; ComponentLink2URL: http://www.st.com/internet/com/TECHNICAL_RESOURCES/TECHNICAL_LITERATURE/DATASHEET/CD00000544.pdf; ComponentLink1Description: Manufacturer URL; DatasheetVersion: 1/11/2011; ComponentLink1URL: http://www.st.com
Y1 = CMP-2000-05733-3: Crystal 25MHz ±20ppm (Tol) ±30ppm (Stability) 18pF FUND 60Ω 4-Pin SMD T/R; Series Resistance: 60R; Length: 3.2mm; Depth: 2.5mm; Packaging: Tape and Reel; Min Operating Temperature: -40°C; Operating Frequency: 25 MHz; Lead Free: Lead Free; Number of Pins: 4; Frequency Tolerance: 20ppm; Radiation Hardening: No; Max Operating Temperature: 85°C; Termination: SMD/SMT; Frequency Stability: 30ppm; Frequency: 25MHz; Series: ABM8G; Mount: Surface Mount; Package Quantity: 1000; Height: 0.039inch; Width: 0.098inch; Case/Package: CSMD; ESR (Equivalent Series Resistance): 60R; Load Capacitance: 18pF; Tolerance: 20ppm

## Sheet RECOVERY_USBC.SchDoc
size A4; SheetNumber: 8; SheetTotal: 19
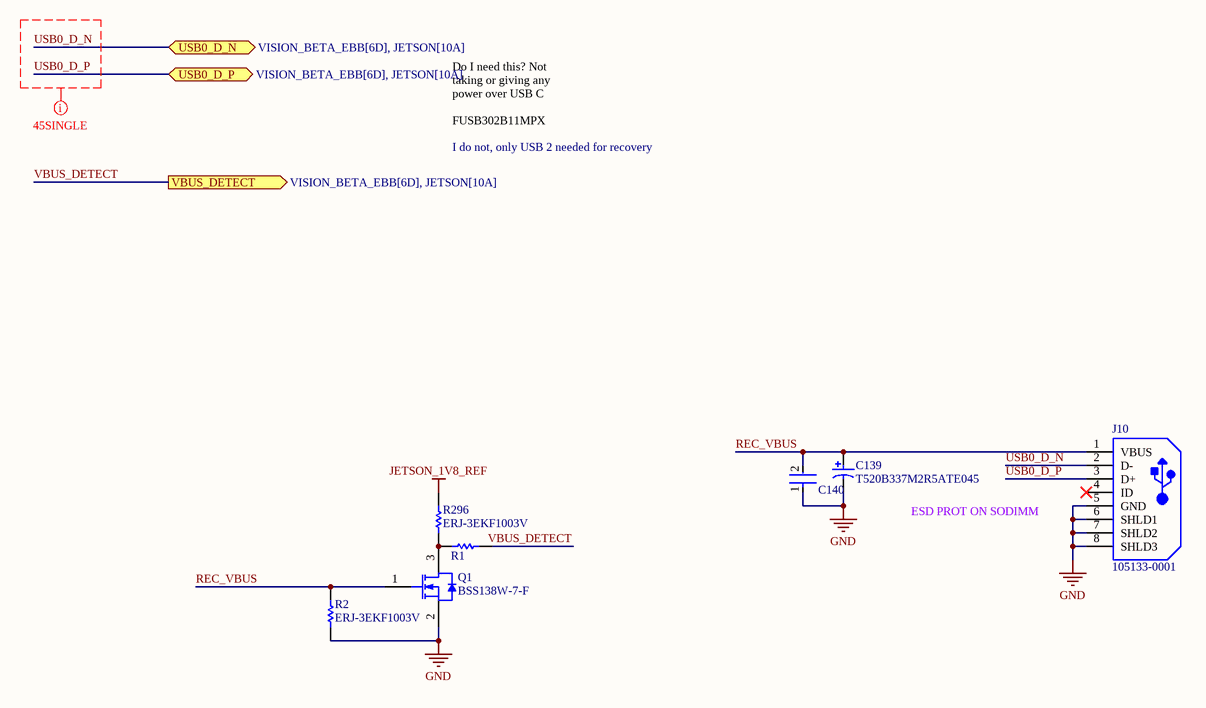
[diagram p27: RECOVERY_USBC.SchDoc]

### Parts
C139  T520B337M2R5ATE045  [KEMT-520-B-2_M]
C140  C1005X7R1H104K050BB  [FP-C1005-050-0_05-IPC_C]  (value not drawn)
J10  105133-0001  [MOLX-105133-0001_V]
Q1  BSS138W-7-F  [DIOD-SOT323-3_V]
R1  0402 JUMPER  [RESC1005X40X25ML05T05]  (value not drawn)
R2  ERJ-3EKF1003V  [RESC1608X55X30ML15T15]
R296  ERJ-3EKF1003V  [RESC1608X55X30ML15T15]

### Ports
USB0_D_N (bidir, see VISION_BETA_EBB[6D], JETSON[10A]), USB0_D_P (bidir, see VISION_BETA_EBB[6D], JETSON[10A]), VBUS_DETECT (out, see VISION_BETA_EBB[6D], JETSON[10A])

### Nets
GND: C139.2 C140.1 J10.5(GND) J10.6(SHLD1) J10.7(SHLD2) J10.8(SHLD3) Q1.2(S) R2.1
JETSON_1V8_REF: R296.2  [project net FAN_VDDIO]
REC_VBUS: C139.1 C140.2 J10.1(VBUS) Q1.1(G) R2.2
USB0_D_N: J10.2(D-) ; port USB0_D_N
USB0_D_P: J10.3(D+) ; port USB0_D_P
VBUS_DETECT: R1.2 ; port VBUS_DETECT
NetQ1_3: Q1.3(D) R1.1 R296.1

Not connected (* = marked no-connect by the designer): J10 4(ID)*

### Layout directives
net class 45SINGLE: USB0_D_N, USB0_D_P

### Notes on the sheet
- Do I need this? Not taking or giving any power over USB C
  FUSB302B11MPX
- I do not, only USB 2 needed for recovery
- ESD PROT ON SODIMM

### Library data of the parts
C139 = CMP-1664-00002-2: Tantalum Capacitor, 330 uF, +/- 20%, 2.5 V, -55 to 105 degC, 2-Pin Molded, RoHS, Tape and Reel; Capacitance: 330 uF; PartNumber: T520B337M2R5ATE045; DatasheetVersion: 07/2016; Radiation Hardening: No; ComponentLink2Description: Datasheet; PackageDescription: 2-Pin Surface Mount Device, Body 3.5 x 2.8 mm; Width: 2.8 mm; ComponentLink2URL: http://capacitoredge.kemet.com/capedge2/DataSheet?pn=T520B337M2R5ATE045; Case/Package: 1411; Length: 3.5 mm; Package Quantity: 2000; Max Operating Temperature: 105 degC; Mounting Technology: Surface Mount; Height: 2.1 mm; RoHSCompliant: True; ComponentLink1URL: http://www.kemet.com/; Mount: Surface Mount; Packaging: Tape and Reel; ComponentLink1Description: Manufacturer URL; Min Operating Temperature: -55 degC
C140 = CMP-2000-05393-2: as C102 on sheet HDMI; Voltage: 50V; Dielectric Material: Ceramic; Min Operating Temperature: -55°C; Depth: 0.5mm; Radiation Hardening: No; RoHS Compliant: Yes; Voltage Rating (DC): 50V; Lead Free: Lead Free; Resistor Type: Ceramic; Height: 0.5mm; Dielectric: X7R; Thickness: 0.022inch; Case/Package: 0402; Case Code (Metric): 1005; Termination: SMD/SMT; Capacitance: 100nF; Packaging: Tape and Reel; Max Operating Temperature: 125°C; Mount: Surface Mount; Package Quantity: 1; Width: 0.02inch; Weight: 2.3E-05oz; Voltage Rating: 50V; Tolerance: 10%; Construction: Flat; Case Code (Imperial): 0402; Length: 1mm; REACH SVHC: No SVHC; Series: C
J10 = CMP-2000-05829-1: Micro-USB B Receptacle, Vertical, -30 to 85 degC, 5-Pin SMD, RoHS, Tape and Reel; Manufacturer: Molex; Package Version: Rev. C, 11/2015; Voltage Rating: 30VAC; Connector Type: MicroUSBTypeBReceptacle; Current Rating: 1.8A; Number of Ports: 1; Voltage - Max: 30V; Mounting Style: SMD/SMT; Packaging: Reel; Product: MicroUSBTypeBConnectors; Contact Plating: Gold; Flammability Rating: UL94V-0; Package Description: 5-Pin Surface Mount Device, Pitch 0.65 mm; Package Reference: 105133-0001; Contact Material: CopperAlloy; Mounting Angle: Vertical; RoHS: Details; Manufacturer URL: http://www.molex.com/; Factory Pack Quantity: 6000; PartNumber: 105133-0001; Standard: USB; Brand: Molex; Series: 105133; Product Category: USBConnectors; Termination Style: SolderTail; Gender: Receptacle; Package URL: http://www.molex.com/pdm_docs/sd/1051330001_sd.pdf; Datasheet Version: 03/2016; Color: Black; Datasheet URL: http://www.molex.com/webdocs/datasheets/pdf/en-us/1051330001_IO_CONNECTORS.pdf; Mounting Technology: SurfaceMount
Q1 = CMP-2000-05968-1: as Q2-Q6 on sheet HDMI; Manufacturer URL: http://www.diodes.com/; Series: BSS138; Package Description: 3-Pin Small Outline Transistor, Body 2 x 1.25 mm, Pitch 0.65 mm; Mounting Technology: SurfaceMount; Product Category: MOSFET; RoHS: True; Maximum Operating Temperature: +150C; Height: 1mm; Length: 2.2mm; Technology: Si; Width: 1.35mm; Datasheet URL: http://www.diodes.com/_files/datasheets/ds30206.pdf; Manufacturer: DiodesIncorporated; Package / Case: SOT-323-3; Typical Turn-On Delay Time: 20ns; Transistor Polarity: N-Channel; Factory Pack Quantity: 3000; Packaging: Reel; Product: MOSFETSmallSignal; Datasheet Version: Rev. 11-2, 09/2013; Package Reference: SOT323; Minimum Operating Temperature: -55C; Mounting Style: SMD/SMT; Channel Mode: Enhancement
R1 = CMP-009-00118-2: READ THE NAME; Pins: 2; Component Type: Standard; Design Item ID: CMP-009-00206-2; Source: 0402jump.SchLib
R2 R296 = CMP-2000-00182-1: Manufacturer: Panasonic; Part Number: ERJ-3EKF1003V

## Sheet PWR_MGMT.SchDoc
size C; SheetNumber: 15; SheetTotal: 19
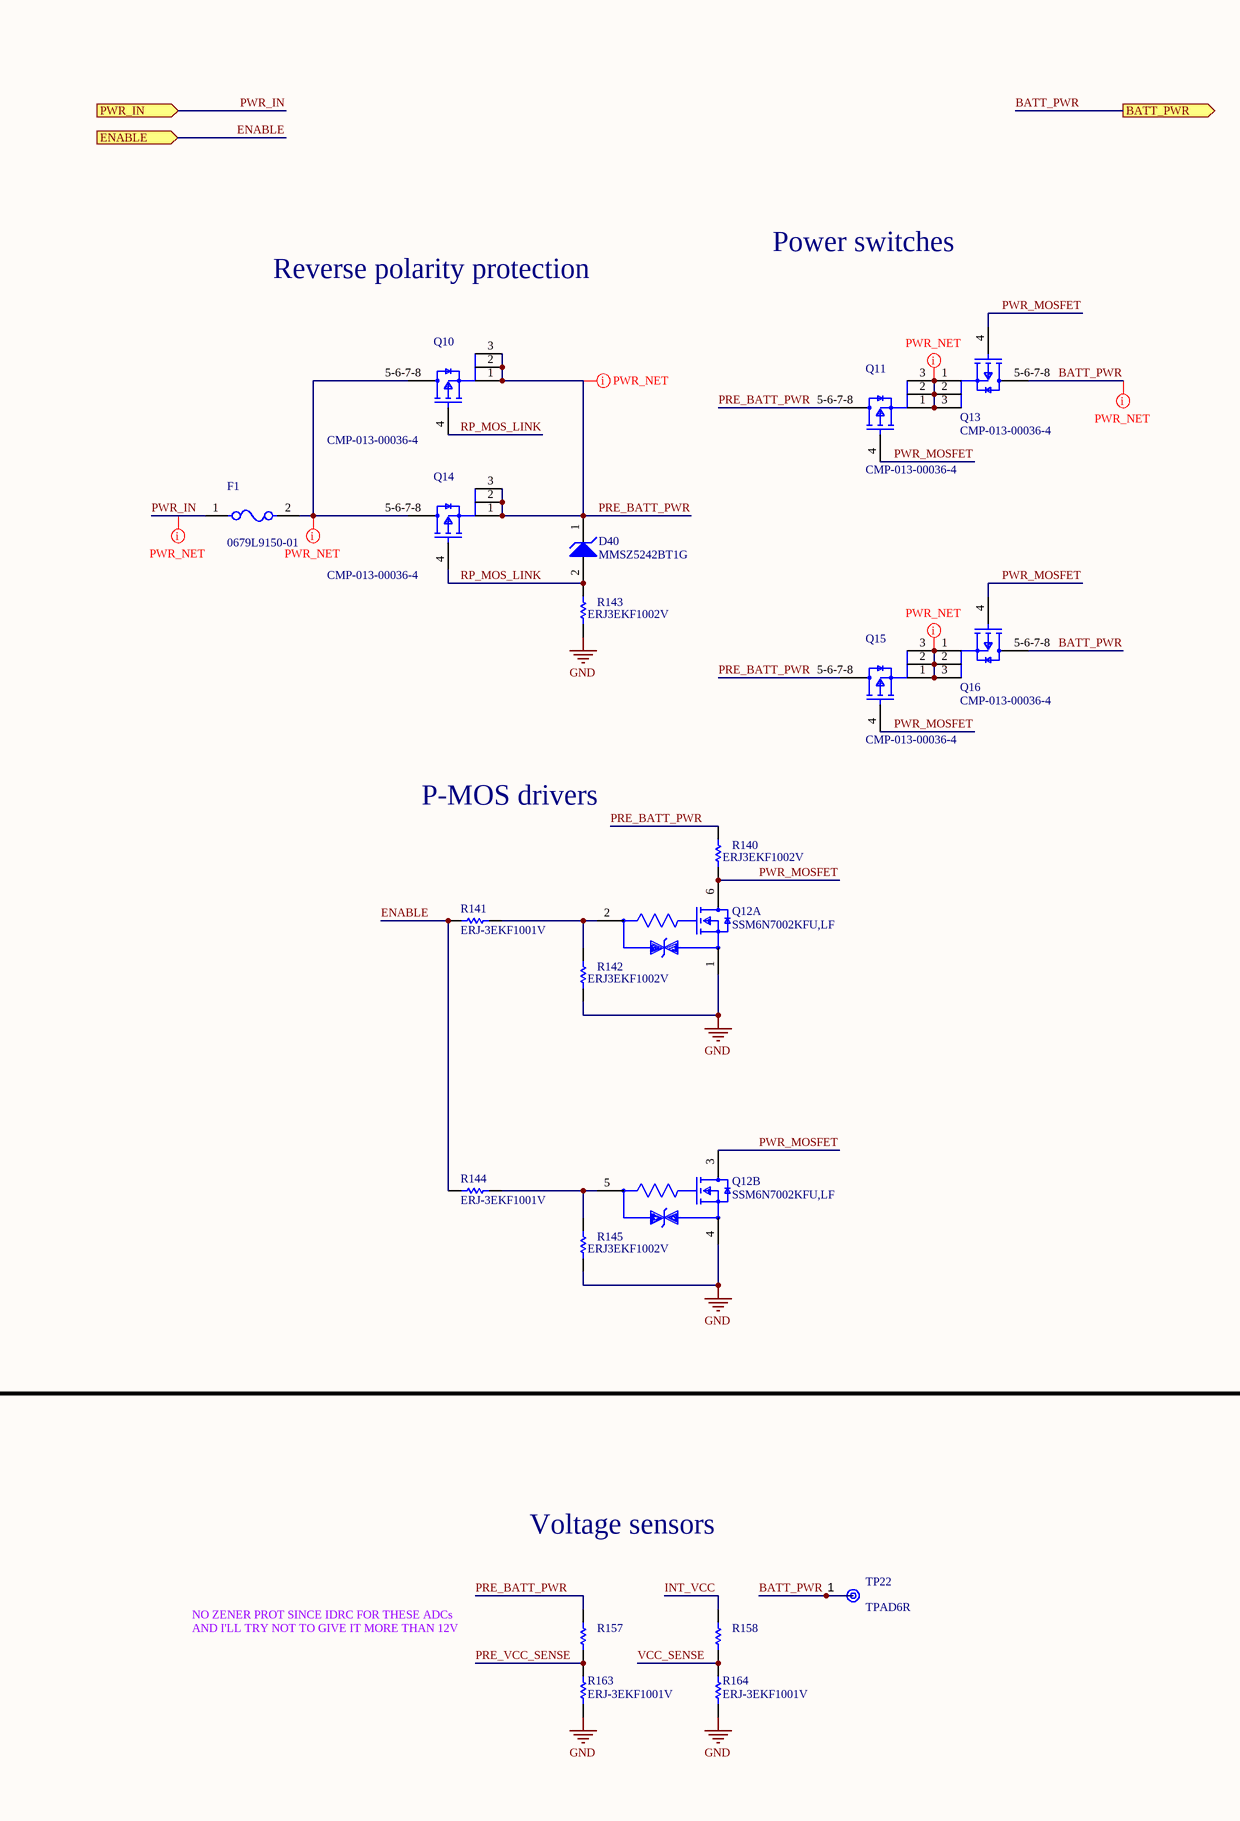
[diagram p28: PWR_MGMT.SchDoc, left]
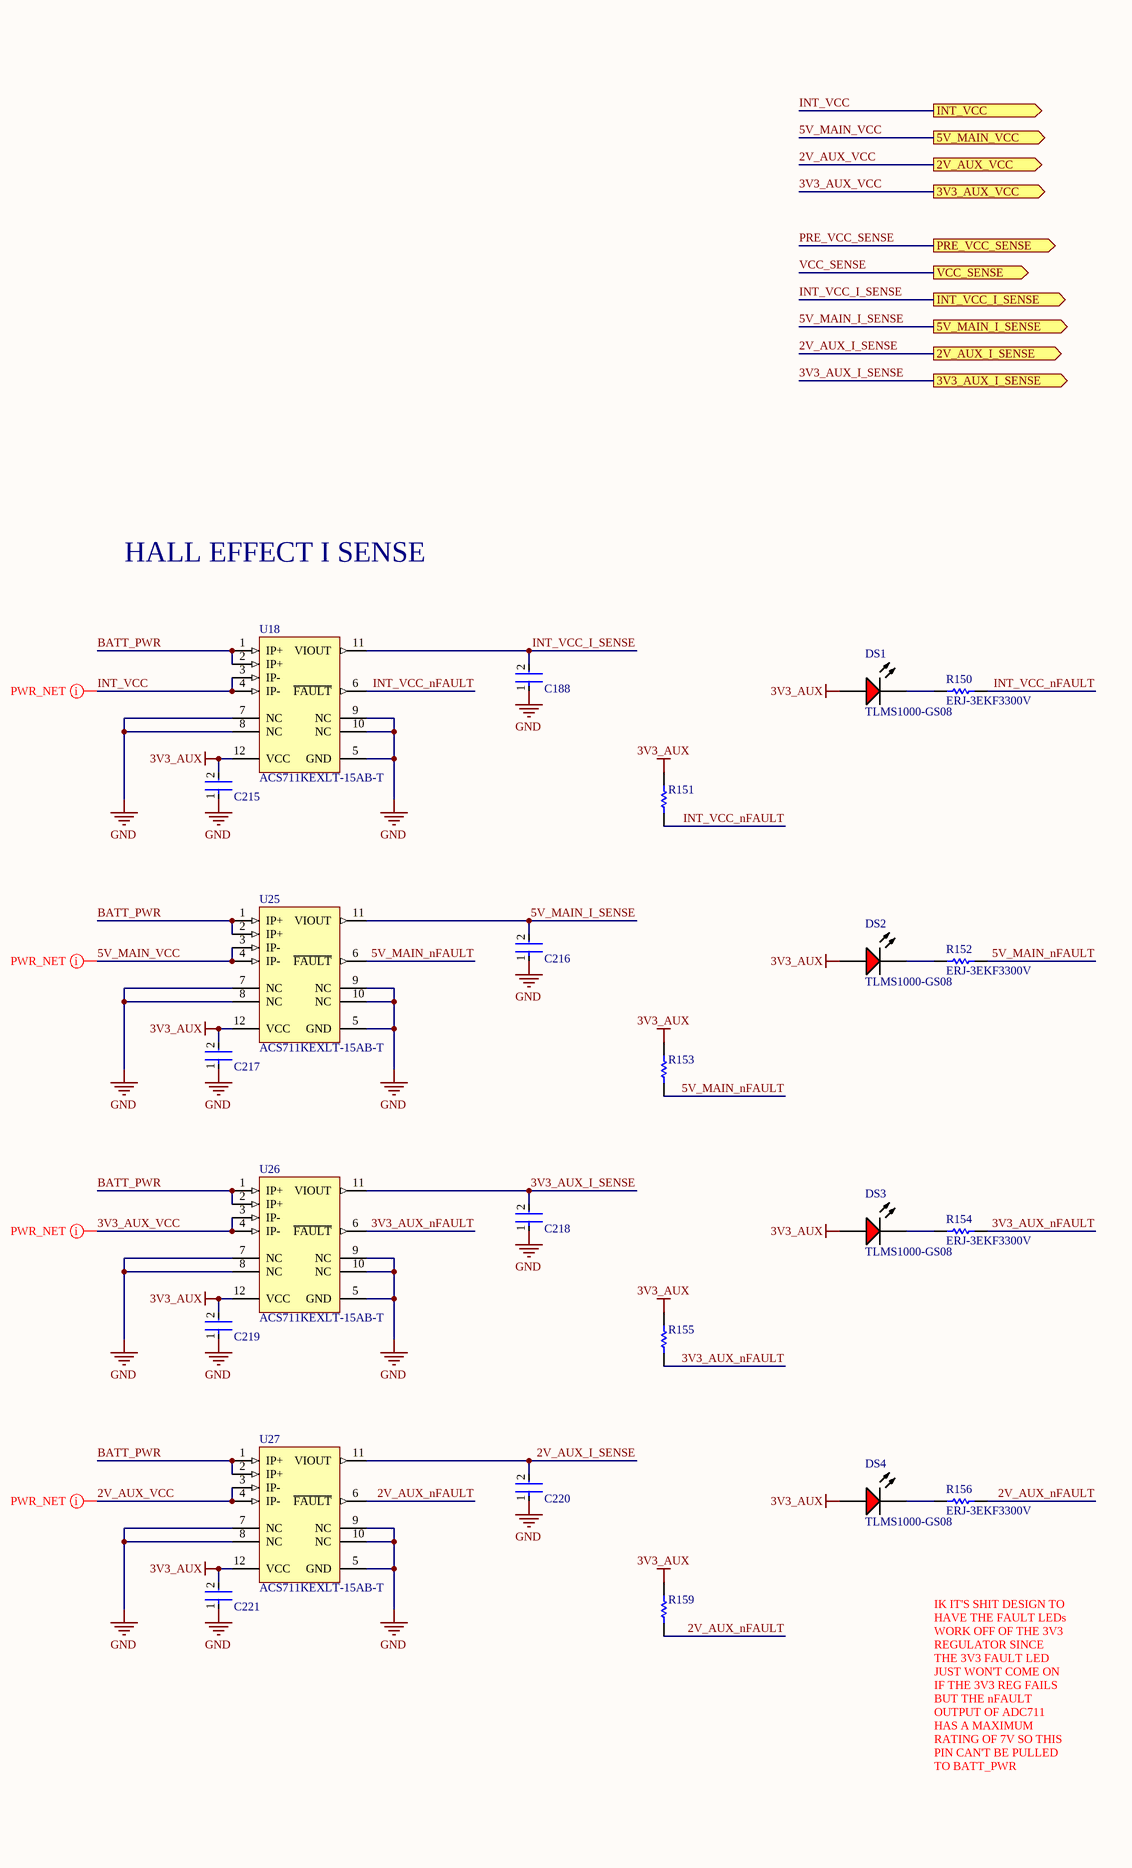
[diagram p29: PWR_MGMT.SchDoc, right]

### Parts
C188  C0402C104K8PACTU  [FP-C0402-BB-MFG]  (value not drawn)
C215  C0402C104K8PACTU  [FP-C0402-BB-MFG]  (value not drawn)
C216  C0402C104K8PACTU  [FP-C0402-BB-MFG]  (value not drawn)
C217  C0402C104K8PACTU  [FP-C0402-BB-MFG]  (value not drawn)
C218  C0402C104K8PACTU  [FP-C0402-BB-MFG]  (value not drawn)
C219  C0402C104K8PACTU  [FP-C0402-BB-MFG]  (value not drawn)
C220  C0402C104K8PACTU  [FP-C0402-BB-MFG]  (value not drawn)
C221  C0402C104K8PACTU  [FP-C0402-BB-MFG]  (value not drawn)
D40  MMSZ5242BT1G  [ONSC-SOD-123-2-425-04_V]
DS1  TLMS1000-GS08  [VISH-TLMS1000_V]
DS2  TLMS1000-GS08  [VISH-TLMS1000_V]
DS3  TLMS1000-GS08  [VISH-TLMS1000_V]
DS4  TLMS1000-GS08  [VISH-TLMS1000_V]
F1  0679L9150-01  [FP-0679L-MFG]
Q10  CMP-013-00036-4  [SISH615ADN-T1-GE3-Footprint-1]
Q11  CMP-013-00036-4  [SISH615ADN-T1-GE3-Footprint-1]
Q12  SSM6N7002KFU,LF  [FP-SSOP6-P-0_65A-MFG]  (parts A,B of 2)
Q13  CMP-013-00036-4  [SISH615ADN-T1-GE3-Footprint-1]
Q14  CMP-013-00036-4  [SISH615ADN-T1-GE3-Footprint-1]
Q15  CMP-013-00036-4  [SISH615ADN-T1-GE3-Footprint-1]
Q16  CMP-013-00036-4  [SISH615ADN-T1-GE3-Footprint-1]
R140  ERJ3EKF1002V  [RESC1609X55X30LL15T15]
R141  ERJ-3EKF1001V  [RESC1608X55X30LL15T15]
R142  ERJ3EKF1002V  [RESC1609X55X30LL15T15]
R143  ERJ3EKF1002V  [RESC1609X55X30LL15T15]
R144  ERJ-3EKF1001V  [RESC1608X55X30LL15T15]
R145  ERJ3EKF1002V  [RESC1609X55X30LL15T15]
R150  ERJ-3EKF3300V  [RESC1608X55X30LL15T15]
R151  ERJ3EKF1002V  [RESC1609X55X30LL15T15]  (value not drawn)
R152  ERJ-3EKF3300V  [RESC1608X55X30LL15T15]
R153  ERJ3EKF1002V  [RESC1609X55X30LL15T15]  (value not drawn)
R154  ERJ-3EKF3300V  [RESC1608X55X30LL15T15]
R155  ERJ3EKF1002V  [RESC1609X55X30LL15T15]  (value not drawn)
R156  ERJ-3EKF3300V  [RESC1608X55X30LL15T15]
R157  ERJ3EKF1002V  [RESC1609X55X30LL15T15]  (value not drawn)
R158  ERJ3EKF1002V  [RESC1609X55X30LL15T15]  (value not drawn)
R159  ERJ3EKF1002V  [RESC1609X55X30LL15T15]  (value not drawn)
R163  ERJ-3EKF1001V  [RESC1608X55X30LL15T15]
R164  ERJ-3EKF1001V  [RESC1608X55X30LL15T15]
TP22  TPAD6R  [New footprint 1]
U18  ACS711KEXLT-15AB-T  [ALEG-EX-12_V]
U25  ACS711KEXLT-15AB-T  [ALEG-EX-12_V]
U26  ACS711KEXLT-15AB-T  [ALEG-EX-12_V]
U27  ACS711KEXLT-15AB-T  [ALEG-EX-12_V]

### Ports
2V_AUX_I_SENSE (out, see VISION_BETA_EBB[3B], ADC[1B]), 2V_AUX_VCC (out, see VISION_BETA_EBB[3B]), 3V3_AUX_I_SENSE (out, see VISION_BETA_EBB[3B], ADC[1B]), 3V3_AUX_VCC (out, see VISION_BETA_EBB[3B]), 5V_MAIN_I_SENSE (out, see VISION_BETA_EBB[3B], ADC[1B]), 5V_MAIN_VCC (out, see VISION_BETA_EBB[3A]), BATT_PWR (out), ENABLE (in, see VISION_BETA_EBB[3B]), INT_VCC (out, see VISION_BETA_EBB[3A]), INT_VCC_I_SENSE (out, see VISION_BETA_EBB[3B], ADC[1B]), PRE_VCC_SENSE (out, see VISION_BETA_EBB[3B], ADC[1A]), PWR_IN (in, see VISION_BETA_EBB[2A]), VCC_SENSE (out, see VISION_BETA_EBB[3B], ADC[1A])

### Nets
3V3_AUX: C215.2 C217.2 C219.2 C221.2 DS1.1(A) DS2.1(A) DS3.1(A) DS4.1(A) R151.2 R153.2 R155.2 R159.2 U18.12(VCC) U25.12(VCC) U26.12(VCC) U27.12(VCC)  [project net 3V3_AUX_FB]
GND: C188.1 C215.1 C216.1 C217.1 C218.1 C219.1 C220.1 C221.1 Q12.1(Source1) Q12.4(Source2) R142.2 R143.2 R145.2 R163.1 R164.1 U18.5(GND) U18.7(NC) U18.8(NC) U18.9(NC) U18.10(NC) U25.5(GND) U25.7(NC) U25.8(NC) U25.9(NC) U25.10(NC) U26.5(GND) U26.7(NC) U26.8(NC) U26.9(NC) U26.10(NC) U27.5(GND) U27.7(NC) U27.8(NC) U27.9(NC) U27.10(NC)
INT_VCC: R158.1 U18.3(IP-) U18.4(IP-) ; port INT_VCC
2V_AUX_I_SENSE: C220.2 U27.11(VIOUT) ; port 2V_AUX_I_SENSE
2V_AUX_nFAULT: R156.2 R159.1 U27.6(~{FAULT})
2V_AUX_VCC: U27.3(IP-) U27.4(IP-) ; port 2V_AUX_VCC
3V3_AUX_I_SENSE: C218.2 U26.11(VIOUT) ; port 3V3_AUX_I_SENSE
3V3_AUX_nFAULT: R154.2 R155.1 U26.6(~{FAULT})
3V3_AUX_VCC: U26.3(IP-) U26.4(IP-) ; port 3V3_AUX_VCC
5V_MAIN_I_SENSE: C216.2 U25.11(VIOUT) ; port 5V_MAIN_I_SENSE
5V_MAIN_nFAULT: R152.2 R153.1 U25.6(~{FAULT})
5V_MAIN_VCC: U25.3(IP-) U25.4(IP-) ; port 5V_MAIN_VCC
BATT_PWR: Q13.5-6-7-8(D) Q16.5-6-7-8(D) TP22.1(TP) U18.1(IP+) U18.2(IP+) U25.1(IP+) U25.2(IP+) U26.1(IP+) U26.2(IP+) U27.1(IP+) U27.2(IP+) ; port BATT_PWR
ENABLE: R141.1 R144.1 ; port ENABLE
INT_VCC_I_SENSE: C188.2 U18.11(VIOUT) ; port INT_VCC_I_SENSE
INT_VCC_nFAULT: R150.2 R151.1 U18.6(~{FAULT})
PRE_BATT_PWR: D40.1(K) Q10.1(S) Q10.2(S) Q10.3(S) Q11.5-6-7-8(D) Q14.1(S) Q14.2(S) Q14.3(S) Q15.5-6-7-8(D) R140.1 R157.1
PRE_VCC_SENSE: R157.2 R163.2 ; port PRE_VCC_SENSE
PWR_IN: F1.1 ; port PWR_IN
PWR_MOSFET: Q11.4(G) Q12.3(Drain2) Q12.6(Drain1) Q13.4(G) Q15.4(G) Q16.4(G) R140.2
RP_MOS_LINK: D40.2(A) Q10.4(G) Q14.4(G) R143.1
VCC_SENSE: R158.2 R164.2 ; port VCC_SENSE
NetDS1_2: DS1.2(K) R150.1
NetDS2_2: DS2.2(K) R152.1
NetDS3_2: DS3.2(K) R154.1
NetDS4_2: DS4.2(K) R156.1
NetF1_2: F1.2 Q10.5-6-7-8(D) Q14.5-6-7-8(D)
NetQ11_1: Q11.1(S) Q11.2(S) Q11.3(S) Q13.1(S) Q13.2(S) Q13.3(S)
NetQ12_2: Q12.2(Gate1) R141.2 R142.1
NetQ12_5: Q12.5(Gate2) R144.2 R145.1
NetQ15_1: Q15.1(S) Q15.2(S) Q15.3(S) Q16.1(S) Q16.2(S) Q16.3(S)

### Layout directives
net class PWR: 2V_AUX_VCC, 3V3_AUX_VCC, 5V_MAIN_VCC, BATT_PWR, INT_VCC, NetF1_2, NetQ11_1, NetQ15_1, PRE_BATT_PWR, PWR_IN

### Notes on the sheet
- Power switches
- Reverse polarity protection
- HALL EFFECT I SENSE
- P-MOS drivers
- Voltage sensors
- NO ZENER PROT SINCE IDRC FOR THESE ADCs
- AND I'LL TRY NOT TO GIVE IT MORE THAN 12V
- IK IT'S SHIT DESIGN TO HAVE THE FAULT LEDs WORK OFF OF THE 3V3 REGULATOR SINCE THE 3V3 FAULT LED JUST WON'T COME ON IF THE 3V3 REG FAILS BUT THE nFAULT OUTPUT OF ADC711 HAS A MAXIMUM RATING OF 7V SO THIS PIN CAN'T BE PULLED TO BATT_PWR

### Library data of the parts
C188 C215-C221 = CMP-2008-02046-2: CAP CER 0.1UF 10V X5R 0402; Manufacturer: Kemet; Material: Ceramic; Capacitance: 0.10 μF; Temperature Coefficient: 15%; Tolerance: 0.1; Value: 0.10 μF; Package: C0402-BB; Temperature: -55°C to +125°C; ComponentLink2Description: Datasheet; Temperature Characteristic: X5R; Device Class L1: Passive Components; Height: 0.55mm; Lead Free: Yes; ComponentLink2URL: https://content.kemet.com/datasheets/KEM_C1002_X7R_SMD.pdf; Device Class L2: Capacitors; Temperature Range Low: -55°C; Temperature Range High: +125°C; RoHS: TRUE; Octopart: https://octopart.com/c0402c104k8pactu-kemet-140039; Automotive: No; Mouser Description: Capacitor 100 nF 10 VDC 0402; Category: Cap; Voltage Rating: 10 V; Digikey Description: CAP CER 0.1UF 10V X5R 0402; Ipc Land Pattern Name: CAPC10050X50; Device Class L3: Ceramic Capacitors; Manufacturer Part Number: C0402C104K8PACTU
D40 = CMP-1060-00565-1: Zener Voltage Regulator, 500 mW, 2-Pin SOD-123, Pb-Free, Tape and Reel; Manufacturer: On Semiconductor; P Max (W): 0.5; VZ Typ (V): 12; PartNumber: MMSZ5242BT1G; PackageReference: SOD-123-2-425-04; ComponentLink3URL: http://www.onsemi.com/pub_link/Collateral/425-04.PDF; Mounting Technology: Surface Mount; ComponentLink2Description: Datasheet; ComponentLink1URL: http://www.onsemi.com/; ComponentLink3Description: Package Specification; PackageDescription: 2-Pin SOD, Body 1.6 x 2.69 mm; PackageVersion: Rev. G, 10/2009; ComponentLink1Description: Manufacturer URL; RoHS: Pb-Free; ComponentLink2URL: http://www.onsemi.com/pub_link/Collateral/MMSZ5221BT1-D.PDF; Packing: Tape and Reel; DatasheetVersion: Rev. 12
DS1-DS4 = CMP-2000-07254-1: Low Current LED, 40 mW, 1.8 V, -40 to 100 degC, 2-Pin SMD (0603), RoHS, Tape and Reel; Manufacturer: Vishay; Lens Shape: Rectangular; Automotive Qualification Standard: AEC-Q100; Wavelength Typ: 636nm; SVHC: ToBeAdvised; LED Colour: Red; Bulb Size: 1.6mmx0.8mm; Forward Voltage: 1.8V; Luminous Intensity: 4mcd; Forward Current If: 2mA; Viewing Angle: 80°; Datasheet Version: Rev. 1.7, 02/2011; Datasheet URL: https://datasheet.ciiva.com/5798/1698881-5798337.pdf; LED Mounting: SMD; Packaging: CutTape; Package Reference: TLMS1000; Manufacturer URL: http://www.vishay.com/; Mounting Technology: SurfaceMount; Product Range: -; Package Description: 2-Pin Surface Mount Device, Body 1.6 x 0.8 mm; MSL: MSL2-1year
F1 = CMP-16042-000002-1: FUSE BRD MNT 15A 125VAC/VDC; Manufacturer: Bel Fuse; Max Fuse Ac Voltage: 125V; Fuse Blow Speed: Fast; Fuse I2T: 103.5A2Sec; Fuse Interrupt Ac Current: 50A; Automotive Grade: Grade 1; Value: 0.0038Ω; Fuse Interrupt Dc Current: 300A; Fuse Voltage Drop: 0.13V; Device Class L2: Fuses; ComponentLink2URL: https://www.belfuse.com/resources/CircuitProtection/datasheets/0679L%20Sep2016.pdf; Package: 0679L; Height: 2.79mm; Digikey Description: FUSE BRD MNT 15A 125VAC/VDC; Temperature Range High: +125°C; Device Class L3: unset; Octopart: https://octopart.com/0679l9150-01-bel+fuse-70850665; Temperature Range Low: -55°C; Fuse Current: 15A; Max Fuse Dc Voltage: 125V; Ipc Land Pattern Name: CAPC610254X254; Manufacturer Part Number: 0679L9150-01; Category: Fuse; Lead Free: Yes; Automotive: Yes; Resistance: 0.0038Ω; RoHS: TRUE; Device Class L1: Circuit Protection; ComponentLink2Description: Datasheet; Temperature: -55°C to +125°C; Voltage Rating: 125V
Q10 Q11 Q13-Q16 = CMP-013-00018-2: Trans MOSFET P-CH 20V 22.1A 8-Pin PowerPAK 1212 EP T/R; Component Type: Standard; Design Item ID: CMP-013-00036-4; Pins: 5; Source: SISH615ADN-T1-GE3.SchLib
Q12 = CMP-35916-000009-1: MOSFET 2N-CH 60V 0.3A; Input Capacitance: 40pF; Continuous Drain Current (ID): 300mA; Max Power Dissipation: 285mW; FET Type: 2 N-Channel; Rds On Max: 1.5R; Mount: Surface Mount; Drain to Source Voltage (Vdss): 60V; Packaging: Tape and Reel
R140 R142 R143 R145 R151 R153 R155 R157-R159 = CMP-1012-00623-3: as R75 on sheet HDMI; Number of Pins: 2; Package Reference: 603; Depth: 0.8mm; Mount: SurfaceMount; Package Description: 2-Pin Surface Mount Device, Body 1.6 x 0.85 mm; Datasheet Version: 02/2017; Length: 1.6mm; Lead Free: LeadFree; Height: 0.45mm; Number of Terminations: 2; Max Power Dissipation: 100mW; Min Operating Temperature: -55degC; Datasheet URL: https://industrial.panasonic.com/cdbs/www-data/pdf/RDA0000/AOA0000C304.pdf; Termination: SMD/SMT; Case Code (Metric): 1608; Case Code (Imperial): 0603; Tolerance: 1%; Max Operating Temperature: 155degC; RoHSCompliant: true; Voltage Rating (DC): 75V; Radiation Hardening: No; Packaging: TapeandReel; Composition: ThickFilm; Mounting Technology: SurfaceMount; Manufacturer URL: http://www.panasonic.com/; Width: 0.031inch; REACH SVHC: NoSVHC; Contact Plating: Tin; Military Standard: Not; Package Quantity: 1
R141 R144 R163 R164 = CMP-2000-00180-1: Manufacturer: Panasonic; Part Number: ERJ-3EKF1001V
R150 R152 R154 R156 = CMP-2000-00435-2: Chip Resistor, 330 Ohm, +/- 1%, 0.1 W, -55 to 155 degC, 0603 (1608 Metric), RoHS, Tape and Reel; Gender: Male; Mating Cycles: 10000; Current Rating: 500 mA; Voltage Rating: 10 V; REACH SVHC: No SVHC; PackageDescription: 2-Pin Surface Mount Device, Body 1.6 x 0.85 mm; Contact Finish: Gold; Pins: 8; ComponentLink1Description: Manufacturer URL; Packaging: Tape and Reel; Max Operating Temperature: 85 degC; Contact Material: Copper; Height: 1.45 mm; Width: 1.45 mm; DatasheetVersion: Apr-15; Package Quantity: 1500; Contact Plating: Gold; PackageReference: 0603; Mount: Surface Mount; Lead Pitch: 1.1 mm; Min Operating Temperature: -25 degC; ComponentLink1URL: http://www.panasonic.com/; ComponentLink2URL: http://industrial.panasonic.com/cdbs/www-data/pdf/RDA0000/AOA0000C86.pdf; Length: 13.7 mm; ComponentLink2Description: Datasheet; RoHSCompliant: true
TP22 = CMP-00025-2: Test Point .6mm
U18 U25-U27 = CMP-1557-00001-1: Hall Effect Linear Current Sensor with Overcurrent Fault Output for <100 V Isolation Applications, 3 to 5.5 V, -15.5 to 15.5 A IP, -40 to 125 degC, 12-Pin QFN (EX), RoHS, Tape and Reel; VCC Max: 5.5 V; IP Max: 15.5 A; VCC Min: 3 V; IP Min: -15.5 A; -3dB Bandwidth: 0.1 MHz; PackageDescription: 12-Pin Quad Flat No-Lead, Body 3 x 3 mm, Height 0.8 mm; ComponentLink1URL: http://www.allegromicro.com/; Packing: Tape and Reel; ComponentLink2URL: http://www.allegromicro.com/~/media/Files/Datasheets/ACS711-Datasheet.ashx?la=en; DatasheetVersion: Rev. 3; PartNumber: ACS711KEXLT-15AB-T; ComponentLink2Description: Datasheet; ComponentLink3URL: http://www.allegromicro.com/~/media/Files/Datasheets/ACS711-Datasheet.ashx?la=en; RoHS: TRUE; ComponentLink1Description: Manufacturer URL; ComponentLink3Description: Package Specification; Temperature Max: 125 degC; Mounting Technology: Surface Mount; Temperature Min: -40 degC